# Altium project 8MPLUSLPD4-CPU.PrjPcb (part 2 of 3)

## Sheet Page07 CPU PHY.SchDoc
size 513 x 386 mm
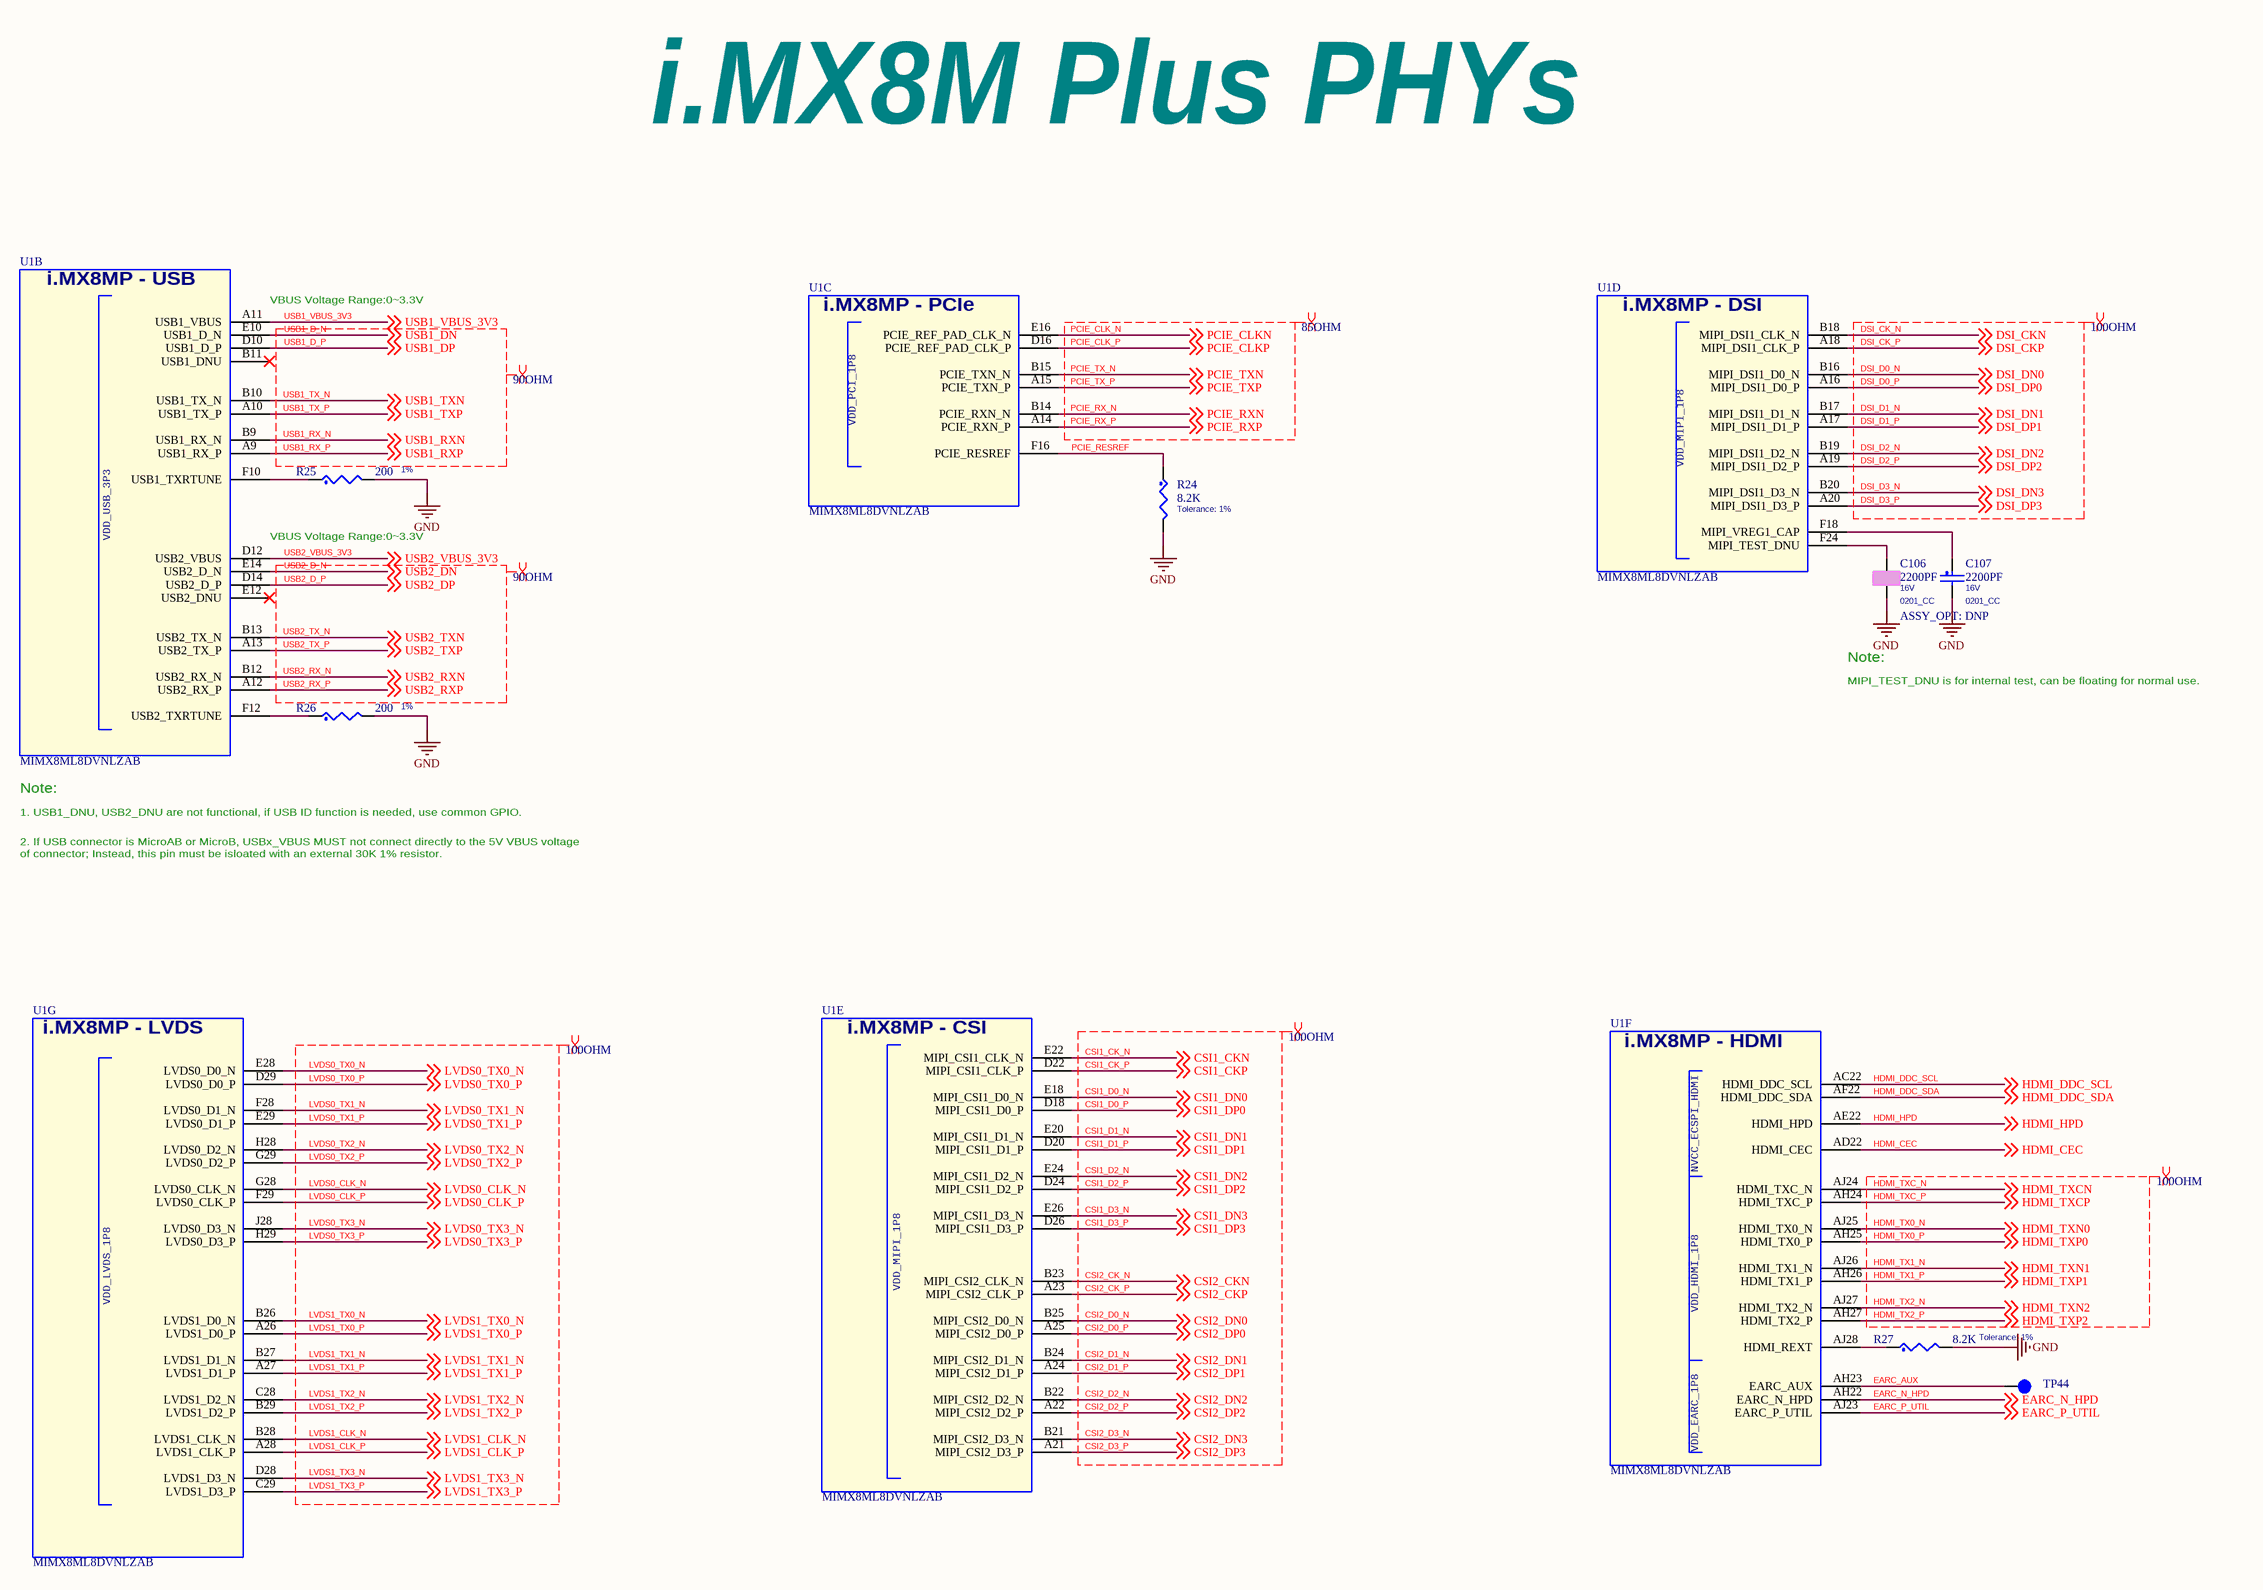
[diagram p8: Page07 CPU PHY.SchDoc]

### Parts
C106  2200PF  ASSY_OPT: DNP  VOLTAGE: 16V  [0201_CC]
C107  2200PF  VOLTAGE: 16V  [0201_CC]
R24  8.2K  Tolerance: 1%  [0201_CC]
R25  200  Tolerance: 1%  [0201_CC]
R26  200  Tolerance: 1%  [0201_CC]
R27  8.2K  Tolerance: 1%  [0201_CC]
TP44  tpad_020  [tpad_020]  (value not drawn)
U1  MIMX8ML8DVNLZAB  [BGA_M865S_0P5_15X15-BMS]  (parts B,C,D,E,F,G of 15)

### Nets
GND: C106.2 C107.2 R24.2 R25.2 R26.2 R27.2
CSI1_CK_N: U1.E22(MIPI_CSI1_CLK_N) ; off-sheet CSI1_CKN  [also labelled CSI1_CKN]
CSI1_CK_P: U1.D22(MIPI_CSI1_CLK_P) ; off-sheet CSI1_CKP  [also labelled CSI1_CKP]
CSI1_D0_N: U1.E18(MIPI_CSI1_D0_N) ; off-sheet CSI1_DN0  [also labelled CSI1_DN0]
CSI1_D0_P: U1.D18(MIPI_CSI1_D0_P) ; off-sheet CSI1_DP0  [also labelled CSI1_DP0]
CSI1_D1_N: U1.E20(MIPI_CSI1_D1_N) ; off-sheet CSI1_DN1  [also labelled CSI1_DN1]
CSI1_D1_P: U1.D20(MIPI_CSI1_D1_P) ; off-sheet CSI1_DP1  [also labelled CSI1_DP1]
CSI1_D2_N: U1.E24(MIPI_CSI1_D2_N) ; off-sheet CSI1_DN2  [also labelled CSI1_DN2]
CSI1_D2_P: U1.D24(MIPI_CSI1_D2_P) ; off-sheet CSI1_DP2  [also labelled CSI1_DP2]
CSI1_D3_N: U1.E26(MIPI_CSI1_D3_N) ; off-sheet CSI1_DN3  [also labelled CSI1_DN3]
CSI1_D3_P: U1.D26(MIPI_CSI1_D3_P) ; off-sheet CSI1_DP3  [also labelled CSI1_DP3]
CSI2_CK_N: U1.B23(MIPI_CSI2_CLK_N) ; off-sheet CSI2_CKN  [also labelled CSI2_CKN]
CSI2_CK_P: U1.A23(MIPI_CSI2_CLK_P) ; off-sheet CSI2_CKP  [also labelled CSI2_CKP]
CSI2_D0_N: U1.B25(MIPI_CSI2_D0_N) ; off-sheet CSI2_DN0  [also labelled CSI2_DN0]
CSI2_D0_P: U1.A25(MIPI_CSI2_D0_P) ; off-sheet CSI2_DP0  [also labelled CSI2_DP0]
CSI2_D1_N: U1.B24(MIPI_CSI2_D1_N) ; off-sheet CSI2_DN1  [also labelled CSI2_DN1]
CSI2_D1_P: U1.A24(MIPI_CSI2_D1_P) ; off-sheet CSI2_DP1  [also labelled CSI2_DP1]
CSI2_D2_N: U1.B22(MIPI_CSI2_D2_N) ; off-sheet CSI2_DN2  [also labelled CSI2_DN2]
CSI2_D2_P: U1.A22(MIPI_CSI2_D2_P) ; off-sheet CSI2_DP2  [also labelled CSI2_DP2]
CSI2_D3_N: U1.B21(MIPI_CSI2_D3_N) ; off-sheet CSI2_DN3  [also labelled CSI2_DN3]
CSI2_D3_P: U1.A21(MIPI_CSI2_D3_P) ; off-sheet CSI2_DP3  [also labelled CSI2_DP3]
DSI_CK_N: U1.B18(MIPI_DSI1_CLK_N) ; off-sheet DSI_CKN  [also labelled DSI_CKN]
DSI_CK_P: U1.A18(MIPI_DSI1_CLK_P) ; off-sheet DSI_CKP  [also labelled DSI_CKP]
DSI_D0_N: U1.B16(MIPI_DSI1_D0_N) ; off-sheet DSI_DN0  [also labelled DSI_DN0]
DSI_D0_P: U1.A16(MIPI_DSI1_D0_P) ; off-sheet DSI_DP0  [also labelled DSI_DP0]
DSI_D1_N: U1.B17(MIPI_DSI1_D1_N) ; off-sheet DSI_DN1  [also labelled DSI_DN1]
DSI_D1_P: U1.A17(MIPI_DSI1_D1_P) ; off-sheet DSI_DP1  [also labelled DSI_DP1]
DSI_D2_N: U1.B19(MIPI_DSI1_D2_N) ; off-sheet DSI_DN2  [also labelled DSI_DN2]
DSI_D2_P: U1.A19(MIPI_DSI1_D2_P) ; off-sheet DSI_DP2  [also labelled DSI_DP2]
DSI_D3_N: U1.B20(MIPI_DSI1_D3_N) ; off-sheet DSI_DN3  [also labelled DSI_DN3]
DSI_D3_P: U1.A20(MIPI_DSI1_D3_P) ; off-sheet DSI_DP3  [also labelled DSI_DP3]
EARC_AUX: TP44.1(Pin1) U1.AH23(EARC_AUX)
EARC_N_HPD: U1.AH22(EARC_N_HPD) ; off-sheet EARC_N_HPD
EARC_P_UTIL: U1.AJ23(EARC_P_UTIL) ; off-sheet EARC_P_UTIL
HDMI_CEC: U1.AD22(HDMI_CEC) ; off-sheet HDMI_CEC
HDMI_DDC_SCL: U1.AC22(HDMI_DDC_SCL) ; off-sheet HDMI_DDC_SCL
HDMI_DDC_SDA: U1.AF22(HDMI_DDC_SDA) ; off-sheet HDMI_DDC_SDA
HDMI_HPD: U1.AE22(HDMI_HPD) ; off-sheet HDMI_HPD
HDMI_TX0_N: U1.AJ25(HDMI_TX0_N) ; off-sheet HDMI_TXN0  [also labelled HDMI_TXN0]
HDMI_TX0_P: U1.AH25(HDMI_TX0_P) ; off-sheet HDMI_TXP0  [also labelled HDMI_TXP0]
HDMI_TX1_N: U1.AJ26(HDMI_TX1_N) ; off-sheet HDMI_TXN1  [also labelled HDMI_TXN1]
HDMI_TX1_P: U1.AH26(HDMI_TX1_P) ; off-sheet HDMI_TXP1  [also labelled HDMI_TXP1]
HDMI_TX2_N: U1.AJ27(HDMI_TX2_N) ; off-sheet HDMI_TXN2  [also labelled HDMI_TXN2]
HDMI_TX2_P: U1.AH27(HDMI_TX2_P) ; off-sheet HDMI_TXP2  [also labelled HDMI_TXP2]
HDMI_TXC_N: U1.AJ24(HDMI_TXC_N) ; off-sheet HDMI_TXCN  [also labelled HDMI_TXCN]
HDMI_TXC_P: U1.AH24(HDMI_TXC_P) ; off-sheet HDMI_TXCP  [also labelled HDMI_TXCP]
LVDS0_CLK_N: U1.G28(LVDS0_CLK_N) ; off-sheet LVDS0_CLK_N
LVDS0_CLK_P: U1.F29(LVDS0_CLK_P) ; off-sheet LVDS0_CLK_P
LVDS0_TX0_N: U1.E28(LVDS0_D0_N) ; off-sheet LVDS0_TX0_N
LVDS0_TX0_P: U1.D29(LVDS0_D0_P) ; off-sheet LVDS0_TX0_P
LVDS0_TX1_N: U1.F28(LVDS0_D1_N) ; off-sheet LVDS0_TX1_N
LVDS0_TX1_P: U1.E29(LVDS0_D1_P) ; off-sheet LVDS0_TX1_P
LVDS0_TX2_N: U1.H28(LVDS0_D2_N) ; off-sheet LVDS0_TX2_N
LVDS0_TX2_P: U1.G29(LVDS0_D2_P) ; off-sheet LVDS0_TX2_P
LVDS0_TX3_N: U1.J28(LVDS0_D3_N) ; off-sheet LVDS0_TX3_N
LVDS0_TX3_P: U1.H29(LVDS0_D3_P) ; off-sheet LVDS0_TX3_P
LVDS1_CLK_N: U1.B28(LVDS1_CLK_N) ; off-sheet LVDS1_CLK_N
LVDS1_CLK_P: U1.A28(LVDS1_CLK_P) ; off-sheet LVDS1_CLK_P
LVDS1_TX0_N: U1.B26(LVDS1_D0_N) ; off-sheet LVDS1_TX0_N
LVDS1_TX0_P: U1.A26(LVDS1_D0_P) ; off-sheet LVDS1_TX0_P
LVDS1_TX1_N: U1.B27(LVDS1_D1_N) ; off-sheet LVDS1_TX1_N
LVDS1_TX1_P: U1.A27(LVDS1_D1_P) ; off-sheet LVDS1_TX1_P
LVDS1_TX2_N: U1.C28(LVDS1_D2_N) ; off-sheet LVDS1_TX2_N
LVDS1_TX2_P: U1.B29(LVDS1_D2_P) ; off-sheet LVDS1_TX2_P
LVDS1_TX3_N: U1.D28(LVDS1_D3_N) ; off-sheet LVDS1_TX3_N
LVDS1_TX3_P: U1.C29(LVDS1_D3_P) ; off-sheet LVDS1_TX3_P
PCIE_CLK_N: U1.E16(PCIE_REF_PAD_CLK_N) ; off-sheet PCIE_CLKN  [also labelled PCIE_CLKN]
PCIE_CLK_P: U1.D16(PCIE_REF_PAD_CLK_P) ; off-sheet PCIE_CLKP  [also labelled PCIE_CLKP]
PCIE_RESREF: R24.1 U1.F16(PCIE_RESREF)
PCIE_RX_N: U1.B14(PCIE_RXN_N) ; off-sheet PCIE_RXN  [also labelled PCIE_RXN]
PCIE_RX_P: U1.A14(PCIE_RXN_P) ; off-sheet PCIE_RXP  [also labelled PCIE_RXP]
PCIE_TX_N: U1.B15(PCIE_TXN_N) ; off-sheet PCIE_TXN  [also labelled PCIE_TXN]
PCIE_TX_P: U1.A15(PCIE_TXN_P) ; off-sheet PCIE_TXP  [also labelled PCIE_TXP]
USB1_D_N: U1.E10(USB1_D_N) ; off-sheet USB1_DN  [also labelled USB1_DN]
USB1_D_P: U1.D10(USB1_D_P) ; off-sheet USB1_DP  [also labelled USB1_DP]
USB1_RX_N: U1.B9(USB1_RX_N) ; off-sheet USB1_RXN  [also labelled USB1_RXN]
USB1_RX_P: U1.A9(USB1_RX_P) ; off-sheet USB1_RXP  [also labelled USB1_RXP]
USB1_TX_N: U1.B10(USB1_TX_N) ; off-sheet USB1_TXN  [also labelled USB1_TXN]
USB1_TX_P: U1.A10(USB1_TX_P) ; off-sheet USB1_TXP  [also labelled USB1_TXP]
USB1_VBUS_3V3: U1.A11(USB1_VBUS) ; off-sheet USB1_VBUS_3V3
USB2_D_N: U1.E14(USB2_D_N) ; off-sheet USB2_DN  [also labelled USB2_DN]
USB2_D_P: U1.D14(USB2_D_P) ; off-sheet USB2_DP  [also labelled USB2_DP]
USB2_RX_N: U1.B12(USB2_RX_N) ; off-sheet USB2_RXN  [also labelled USB2_RXN]
USB2_RX_P: U1.A12(USB2_RX_P) ; off-sheet USB2_RXP  [also labelled USB2_RXP]
USB2_TX_N: U1.B13(USB2_TX_N) ; off-sheet USB2_TXN  [also labelled USB2_TXN]
USB2_TX_P: U1.A13(USB2_TX_P) ; off-sheet USB2_TXP  [also labelled USB2_TXP]
USB2_VBUS_3V3: U1.D12(USB2_VBUS) ; off-sheet USB2_VBUS_3V3
NetC106_1: C106.1 U1.F24(MIPI_TEST_DNU)
NetC107_1: C107.1 U1.F18(MIPI_VREG1_CAP)
NetR25_1: R25.1 U1.F10(USB1_TXRTUNE)
NetR26_1: R26.1 U1.F12(USB2_TXRTUNE)
NetR27_1: R27.1 U1.AJ28(HDMI_REXT)

Not connected (* = marked no-connect by the designer): U1 B11(USB1_DNU)* E12(USB2_DNU)*

### Layout directives
differential pair; net class USB; differential pair class 90OHM: USB1_D_N, USB1_D_P, USB1_DN, USB1_DP, USB1_RX_N, USB1_RX_P, USB1_RXN, USB1_RXP, USB1_TX_N, USB1_TX_P, USB1_TXN, USB1_TXP, USB2_D_N, USB2_D_P, USB2_DN, USB2_DP, USB2_RX_N, USB2_RX_P, USB2_RXN, USB2_RXP, USB2_TX_N, USB2_TX_P, USB2_TXN, USB2_TXP
differential pair; net class PCIE; differential pair class 85OHM: PCIE_CLK_N, PCIE_CLK_P, PCIE_CLKN, PCIE_CLKP, PCIE_RX_N, PCIE_RX_P, PCIE_RXN, PCIE_RXP, PCIE_TX_N, PCIE_TX_P, PCIE_TXN, PCIE_TXP
differential pair; net class DSI; differential pair class 100OHM: DSI_CK_N, DSI_CK_P, DSI_CKN, DSI_CKP, DSI_D0_N, DSI_D0_P, DSI_D1_N, DSI_D1_P, DSI_D2_N, DSI_D2_P, DSI_D3_N, DSI_D3_P, DSI_DN0, DSI_DN1, DSI_DN2, DSI_DN3, DSI_DP0, DSI_DP1, DSI_DP2, DSI_DP3
differential pair; net class HDMI; differential pair class 100OHM: HDMI_TX0_N, HDMI_TX0_P, HDMI_TX1_N, HDMI_TX1_P, HDMI_TX2_N, HDMI_TX2_P, HDMI_TXC_N, HDMI_TXC_P, HDMI_TXCN, HDMI_TXCP, HDMI_TXN0, HDMI_TXN1, HDMI_TXN2, HDMI_TXP0, HDMI_TXP1, HDMI_TXP2
differential pair; net class CSI; differential pair class 100OHM: CSI1_CK_N, CSI1_CK_P, CSI1_CKN, CSI1_CKP, CSI1_D0_N, CSI1_D0_P, CSI1_D1_N, CSI1_D1_P, CSI1_D2_N, CSI1_D2_P, CSI1_D3_N, CSI1_D3_P, CSI1_DN0, CSI1_DN1, CSI1_DN2, CSI1_DN3, CSI1_DP0, CSI1_DP1, CSI1_DP2, CSI1_DP3, CSI2_CK_N, CSI2_CK_P, CSI2_CKN, CSI2_CKP, CSI2_D0_N, CSI2_D0_P, CSI2_D1_N, CSI2_D1_P, CSI2_D2_N, CSI2_D2_P, CSI2_D3_N, CSI2_D3_P, CSI2_DN0, CSI2_DN1, CSI2_DN2, CSI2_DN3, CSI2_DP0, CSI2_DP1, CSI2_DP2, CSI2_DP3
differential pair; net class LVDS; differential pair class 100OHM: LVDS0_CLK_N, LVDS0_CLK_P, LVDS0_TX0_N, LVDS0_TX0_P, LVDS0_TX1_N, LVDS0_TX1_P, LVDS0_TX2_N, LVDS0_TX2_P, LVDS0_TX3_N, LVDS0_TX3_P, LVDS1_CLK_N, LVDS1_CLK_P, LVDS1_TX0_N, LVDS1_TX0_P, LVDS1_TX1_N, LVDS1_TX1_P, LVDS1_TX2_N, LVDS1_TX2_P, LVDS1_TX3_N, LVDS1_TX3_P

### Notes on the sheet
- i.MX8M Plus PHYs
- (near U1) VBUS Voltage Range:0~3.3V
- VBUS Voltage Range:0~3.3V
- MIPI_TEST_DNU is for internal test, can be floating for normal use.
- Note:
- 1. USB1_DNU, USB2_DNU are not functional, if USB ID function is needed, use common GPIO.
- 2. If USB connector is MicroAB or MicroB, USBx_VBUS MUST not connect directly to the 5V VBUS voltage
  of connector; Instead, this pin must be isloated with an external 30K 1% resistor.
- (in symbol MIMX8MP_BGA548, part B) i.MX8MP - USB
- (in symbol MIMX8MP_BGA548, part C) i.MX8MP - PCIe
- (in symbol MIMX8MP_BGA548, part D) i.MX8MP - DSI
- (in symbol MIMX8MP_BGA548, part E) i.MX8MP - CSI
- (in symbol MIMX8MP_BGA548, part F) i.MX8MP - HDMI
- (in symbol MIMX8MP_BGA548, part G) i.MX8MP - LVDS

### Library data of the parts
C106 = CAP_NP: CAP CER 2200PF 16V 10% X7R 0201; CLASS: DISCRETE; FPLIST: CC0201,CC0201_HD,0201_CC; CAD_APPROVED: Yes; MFG_PN01: GRM033R71C222KA88D; MFG_NAME01: MURATA; Tolerance: 20%; AGILE_PN: 150-78660; PCB Footprint: 0201_CC; HEIGHT: 0.33 MM; ROHS: Yes
C107 = CAP_NP: CAP CER 2200PF 16V 10% X7R 0201; CLASS: DISCRETE; AGILE_PN: 150-78660; Tolerance: 20%; MFG_NAME01: MURATA; MFG_PN01: GRM033R71C222KA88D; CAD_APPROVED: Yes; FPLIST: CC0201,CC0201_HD,0201_CC; PCB Footprint: 0201_CC; ROHS: Yes; HEIGHT: 0.33 MM
R24 = RES: RES MF 8.2K 1/20W 1% 0201; CLASS: DISCRETE; AGILE_PN: 470-82483; FPLIST: RC0201,0201_CC; CAD_APPROVED: Yes; MFG_NAME01: YAGEO AMERICA; MFG_PN01: RC0201FR-078K2L; PCB Footprint: 0201_CC; Package Size: 0201 (0603 Metric); HEIGHT: 0.26MM; Package Type: SMD; ROHS: Yes
R25 = RES: RES MF 200 OHM 1/20W 1% 0201; CLASS: DISCRETE; FPLIST: RC0201,0201_CC; CAD_APPROVED: Yes; Temp_Range: -55¡ãC ~ 125¡ãC; MFG_PN01: RC0201FR-07200RL; MFG_NAME01: YAGEO AMERICA; AGILE_PN: 470-82323; VOLTAGE: 25V; PCB Footprint: 0201_CC; HEIGHT: 0.26MM; ROHS: Yes; Temp Range: -55¡ãC ~ 125¡ãC
R26 = RES: RES MF 200 OHM 1/20W 1% 0201; CLASS: DISCRETE; AGILE_PN: 470-82323; MFG_NAME01: YAGEO AMERICA; MFG_PN01: RC0201FR-07200RL; Temp_Range: -55¡ãC ~ 125¡ãC; CAD_APPROVED: Yes; FPLIST: RC0201,0201_CC; VOLTAGE: 25V; PCB Footprint: 0201_CC; ROHS: Yes; HEIGHT: 0.26MM; Temp Range: -55¡ãC ~ 125¡ãC
R27 = RES: RES MF 8.2K 1/20W 1% 0201; CLASS: DISCRETE; MFG_PN01: RC0201FR-078K2L; MFG_NAME01: YAGEO AMERICA; CAD_APPROVED: Yes; FPLIST: RC0201,0201_CC; AGILE_PN: 470-82483; PCB Footprint: 0201_CC; ROHS: Yes; Package Type: SMD; HEIGHT: 0.26MM; Package Size: 0201 (0603 Metric)
TP44 = TESTLOOP: as TP49 on sheet Page04 CPU PWR; PCB Footprint: tpad_020; ROHS: Yes; HEIGHT: 0.1MM
U1 = MIMX8MP_BGA548: as U1 on sheet Page04 CPU PWR; CLASS: IC; HEIGHT: 2.1MM; MFG_PN01: MIMX8ML8DVNLZAB

## Sheet Page08 CPU MISC.SchDoc
size 297 x 209 mm
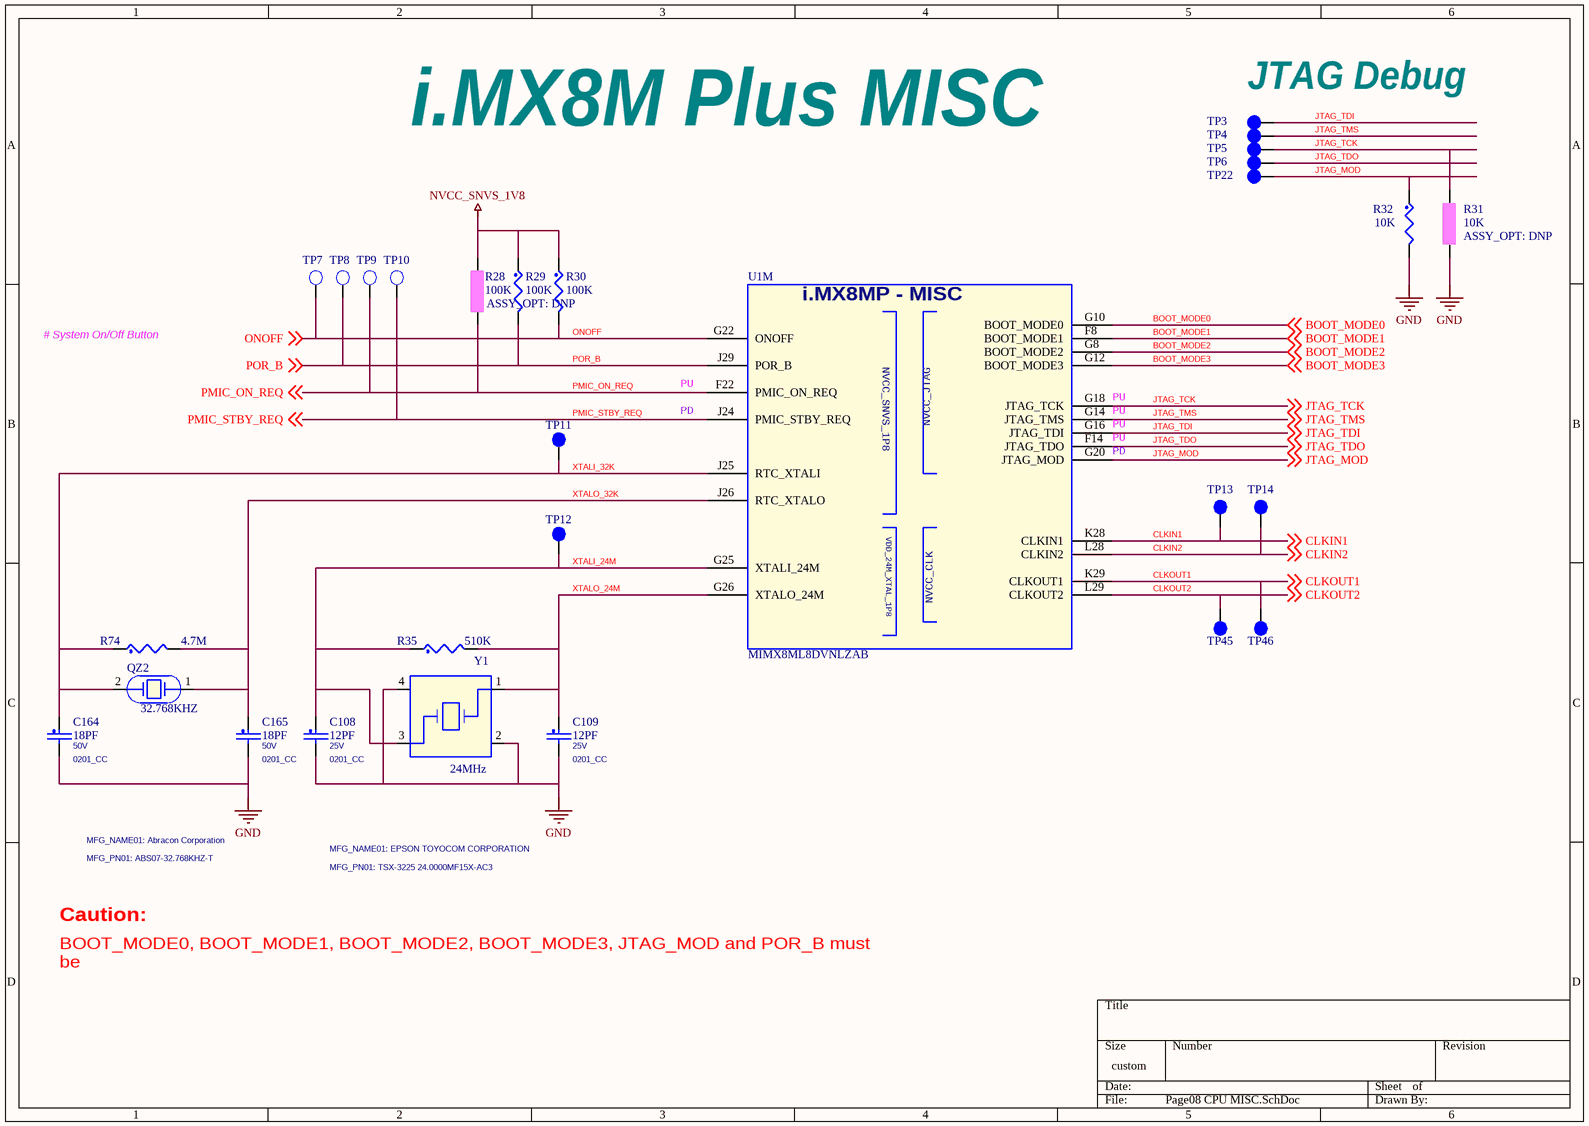
[diagram p9: Page08 CPU MISC.SchDoc]

### Parts
C108  12PF  VOLTAGE: 25V  [0201_CC]
C109  12PF  VOLTAGE: 25V  [0201_CC]
C164  18PF  VOLTAGE: 50V  [0201_CC]
C165  18PF  VOLTAGE: 50V  [0201_CC]
QZ2  32.768KHZ  MFG_PN01: ABS07-32.768KHZ-T  MFG_NAME01: Abracon Corporation  [XTAL2-3P2X1P5-SM]
R28  100K  ASSY_OPT: DNP  [0201_CC]
R29  100K  [0201_CC]
R30  100K  [0201_CC]
R31  10K  ASSY_OPT: DNP  [0201_CC]
R32  10K  [0201_CC]
R35  510K  [0402_CC]
R74  4.7M  [0201_CC]
TP3  tpad_020  [tpad_020]  (value not drawn)
TP4  tpad_020  [tpad_020]  (value not drawn)
TP5  tpad_020  [tpad_020]  (value not drawn)
TP6  tpad_020  [tpad_020]  (value not drawn)
TP7  TP_35MIL  [testpoint_35mil]  (value not drawn)
TP8  TP_35MIL  [testpoint_35mil]  (value not drawn)
TP9  TP_35MIL  [testpoint_35mil]  (value not drawn)
TP10  TP_35MIL  [testpoint_35mil]  (value not drawn)
TP11  TPAD_015  [TPAD_015]  (value not drawn)
TP12  TPAD_015  [TPAD_015]  (value not drawn)
TP13  tpad_020  [tpad_020]  (value not drawn)
TP14  tpad_020  [tpad_020]  (value not drawn)
TP22  tpad_020  [tpad_020]  (value not drawn)
TP45  tpad_020  [tpad_020]  (value not drawn)
TP46  tpad_020  [tpad_020]  (value not drawn)
U1  MIMX8ML8DVNLZAB  [BGA_M865S_0P5_15X15-BMS]  (part M of 15)
Y1  24MHz  MFG_PN01: TSX-3225 24.0000MF15X-AC3  MFG_NAME01: EPSON TOYOCOM CORPORATION  [xtlosc4_3p2x2p5mm_sm]

### Nets
GND: C108.2 C109.2 C164.2 C165.2 R31.2 R32.2 Y1.2 Y1.4
NVCC_SNVS_1V8: R28.1 R29.1 R30.1
BOOT_MODE0: U1.G10(BOOT_MODE0) ; off-sheet BOOT_MODE0
BOOT_MODE1: U1.F8(BOOT_MODE1) ; off-sheet BOOT_MODE1
BOOT_MODE2: U1.G8(BOOT_MODE2) ; off-sheet BOOT_MODE2
BOOT_MODE3: U1.G12(BOOT_MODE3) ; off-sheet BOOT_MODE3
CLKIN1: TP13.1(Pin1) U1.K28(CLKIN1) ; off-sheet CLKIN1
CLKIN2: TP14.1(Pin1) U1.L28(CLKIN2) ; off-sheet CLKIN2
CLKOUT1: TP46.1(Pin1) U1.K29(CLKOUT1) ; off-sheet CLKOUT1
CLKOUT2: TP45.1(Pin1) U1.L29(CLKOUT2) ; off-sheet CLKOUT2
JTAG_MOD: R32.1 TP22.1(Pin1) U1.G20(JTAG_MOD) ; off-sheet JTAG_MOD
JTAG_TCK: R31.1 TP5.1(Pin1) U1.G18(JTAG_TCK) ; off-sheet JTAG_TCK
JTAG_TDI: TP3.1(Pin1) U1.G16(JTAG_TDI) ; off-sheet JTAG_TDI
JTAG_TDO: TP6.1(Pin1) U1.F14(JTAG_TDO) ; off-sheet JTAG_TDO
JTAG_TMS: TP4.1(Pin1) U1.G14(JTAG_TMS) ; off-sheet JTAG_TMS
ONOFF: R30.2 TP7.1(TP) U1.G22(ONOFF) ; off-sheet ONOFF
PMIC_ON_REQ: R28.2 TP9.1(TP) U1.F22(PMIC_ON_REQ) ; off-sheet PMIC_ON_REQ
PMIC_STBY_REQ: TP10.1(TP) U1.J24(PMIC_STBY_REQ) ; off-sheet PMIC_STBY_REQ
POR_B: R29.2 TP8.1(TP) U1.J29(POR_B) ; off-sheet POR_B
XTALI_24M: C108.1 R35.1 TP12.1(Pin1) U1.G25(XTALI_24M) Y1.3
XTALI_32K: C164.1 QZ2.2 R74.1 TP11.1(Pin1) U1.J25(RTC_XTALI)
XTALO_24M: C109.1 R35.2 U1.G26(XTALO_24M) Y1.1
XTALO_32K: C165.1 QZ2.1 R74.2 U1.J26(RTC_XTALO)

### Notes on the sheet
- JTAG Debug
- i.MX8M Plus MISC
- # System On/Off Button
- PU
- (near U1) PU
- (near U1) PD
- BOOT_MODE0, BOOT_MODE1, BOOT_MODE2, BOOT_MODE3, JTAG_MOD and POR_B must be
  pulled to "111111" for i.MX8M Plus to enter Boundary Scan mode.
- Caution:
- (in symbol MIMX8MP_BGA548, part M) i.MX8MP - MISC

### Library data of the parts
C108 = CAP_NP: CAP CER 12PF 25V 5% C0G AEC-Q200 0201; CLASS: DISCRETE; FPLIST: CC0201,CC0201_HD,0201_CC; CAD_APPROVED: Yes; MFG_PN01: CGA1A2C0G1E120J030BA; MFG_NAME01: TDK; AGILE_PN: 150-79813; HEIGHT: 0.33MM; ROHS: Yes; Tolerance: 5%; PCB Footprint: 0201_CC
C109 = CAP_NP: CAP CER 12PF 25V 5% C0G AEC-Q200 0201; CLASS: DISCRETE; AGILE_PN: 150-79813; MFG_NAME01: TDK; MFG_PN01: CGA1A2C0G1E120J030BA; CAD_APPROVED: Yes; FPLIST: CC0201,CC0201_HD,0201_CC; Tolerance: 5%; ROHS: Yes; HEIGHT: 0.33MM; PCB Footprint: 0201_CC
C164 = CAP_NP: CAP CER 18pF 50V 5% C0G 0201; CLASS: DISCRETE; AGILE_PN: 150-79476; MFG_NAME01: MURATA; MFG_PN01: GRM0335C1H180JA01D; CAD_APPROVED: Yes; FPLIST: CC0201,CC0201_HD,0201_CC; Tolerance: 5%; ROHS: Yes; HEIGHT: 0.33MM; PCB Footprint: 0201_CC; Package Size: 0201; Package Type: &#966;180mm Paper taping
C165 = CAP_NP: CAP CER 18pF 50V 5% C0G 0201; CLASS: DISCRETE; FPLIST: CC0201,CC0201_HD,0201_CC; CAD_APPROVED: Yes; MFG_PN01: GRM0335C1H180JA01D; MFG_NAME01: MURATA; AGILE_PN: 150-79476; HEIGHT: 0.33MM; ROHS: Yes; Tolerance: 5%; PCB Footprint: 0201_CC; Package Size: 0201; Package Type: &#966;180mm Paper taping
QZ2 = XTAL: XTAL 32.768KHZ 12.5PF 20PPM 3.2X1.5MM SMT; CLASS: IC; CAD_APPROVED: Yes; AGILE_PN: 230-77653; PCB Footprint: XTAL2-3P2X1P5-SM; HEIGHT: 0.9MM; ROHS: Yes
R28 = RES: RES MF 100K 1/20W 1% 0201; CLASS: DISCRETE; FPLIST: RC0201,0201_CC; CAD_APPROVED: Yes; MFG_PN01: RC-0201-104FT; MFG_NAME01: SKYMOS; AGILE_PN: 470-77704; PCB Footprint: 0201_CC; HEIGHT: 0.26MM; ROHS: Yes; Tolerance: 1%
R29 R30 = RES: RES MF 100K 1/20W 1% 0201; CLASS: DISCRETE; AGILE_PN: 470-77704; MFG_NAME01: SKYMOS; MFG_PN01: RC-0201-104FT; CAD_APPROVED: Yes; FPLIST: RC0201,0201_CC; PCB Footprint: 0201_CC; Tolerance: 1%; ROHS: Yes; HEIGHT: 0.26MM
R31 = RES: RES MF 10K 1/20W 5% 0201; CLASS: DISCRETE; AGILE_PN: 470-79719; MFG_NAME01: RALEC ELECTRONIC CORP; MFG_PN01: RTT01103JTH; CAD_APPROVED: Yes; FPLIST: RC0201,0201_CC; PCB Footprint: 0201_CC; Tolerance: 5%; ROHS: Yes; HEIGHT: 0.26 MM
R32 = RES: RES MF 10K 1/20W 5% 0201; CLASS: DISCRETE; FPLIST: RC0201,0201_CC; CAD_APPROVED: Yes; MFG_PN01: RTT01103JTH; MFG_NAME01: RALEC ELECTRONIC CORP; AGILE_PN: 470-79719; PCB Footprint: 0201_CC; HEIGHT: 0.26 MM; ROHS: Yes; Tolerance: 5%
R35 = RES: RES MF 510K 1/16W 5% 0402; CLASS: DISCRETE; FPLIST: RC0402_25,RC0402_HD,0402_CC; CAD_APPROVED: Yes; MFG_PN01: ERJ-2GEJ514X; MFG_NAME01: PANASONIC; AGILE_PN: 470-76166; PCB Footprint: 0402_CC; HEIGHT: 0.4 MM; ROHS: Yes; Tolerance: 5%
R74 = RES: RES TF 4.7M OHM 1/20W 5% 0201; CLASS: DISCRETE; MFG_PN01: RC0201JR-074M7L; MFG_NAME01: YAGEO AMERICA; Temp Range: -55¡ãC ~ 125C; VOLTAGE: 25V; CAD_APPROVED: Yes; FPLIST: RC0201,0201_CC; AGILE_PN: 470-81235; ROHS: Yes; Tolerance: 5%; HEIGHT: 0.26MM; PCB Footprint: 0201_CC
TP3 TP5 TP45 TP46 = TESTLOOP: TEST POINT PAD 0.5MM DIA SMT, NO PART TO ORDER; ASSY_OPT: DNP; CLASS: IO; CAD_APPROVED: Yes; AGILE_PN: 211-77484; HEIGHT: 0.1MM; ROHS: Yes; PCB Footprint: tpad_020
TP4 TP6 TP13 TP14 TP22 = TESTLOOP: TEST POINT PAD 0.5MM DIA SMT, NO PART TO ORDER; ASSY_OPT: DNP; CLASS: IO; AGILE_PN: 211-77484; CAD_APPROVED: Yes; ROHS: Yes; HEIGHT: 0.1MM; PCB Footprint: tpad_020
TP7 TP9 = T POINT R: TEST POINT PAD .035 SMT, no part to order; CLASS: IC; ASSY_OPT: DNP; AGILE_PN: 510-75618; CAD_APPROVED: Yes; PCB Footprint: testpoint_35mil; ROHS: Yes; HEIGHT: 0.1MM
TP8 TP10 = T POINT R: TEST POINT PAD .035 SMT, no part to order; CLASS: IC; ASSY_OPT: DNP; CAD_APPROVED: Yes; AGILE_PN: 510-75618; PCB Footprint: testpoint_35mil; HEIGHT: 0.1MM; ROHS: Yes
TP11 = TESTLOOP: TEST POINT PAD 15MIL DIA SMT, NO PART TO ORDER; ASSY_OPT: DNP; CLASS: IO; CAD_APPROVED: Yes; MFG_PN01: NOTACOMPONENT; AGILE_PN: 211-76645; PCB Footprint: TPAD_015; HEIGHT: 0.1MM; ROHS: Yes; MFG_NAME01: NOTACOMPONENT
TP12 = TESTLOOP: TEST POINT PAD 15MIL DIA SMT, NO PART TO ORDER; ASSY_OPT: DNP; CLASS: IO; AGILE_PN: 211-76645; MFG_NAME01: NOTACOMPONENT; CAD_APPROVED: Yes; PCB Footprint: TPAD_015; MFG_PN01: NOTACOMPONENT; ROHS: Yes; HEIGHT: 0.1MM
U1 = MIMX8MP_BGA548: IC CPU QUAD CORTEX A53+M4 1.8GHZ BGA548; SPLIT_INST: TRUE; PCB Footprint: bga548_0p5_15x15mm; CAD_APPROVED: Yes; MFG_NAME01: NXP SEMICONDUCTORS; AGILE_PN: 330-77126; CLASS: IC; HEIGHT: 2.1MM; MFG_PN01: MIMX8ML8DVNLZAB
Y1 = XTAL_13Y: XTAL 24MHZ 9pF -- SMT 3.2X2.5MM; CLASS: IC; CAD_APPROVED: Yes; AGILE_PN: 230-77392; PCB Footprint: xtlosc4_3p2x2p5mm_sm; HEIGHT: 0.60MM; ROHS: Yes

## Sheet Page09 eMMC_QSPI.SchDoc
size 386 x 246 mm
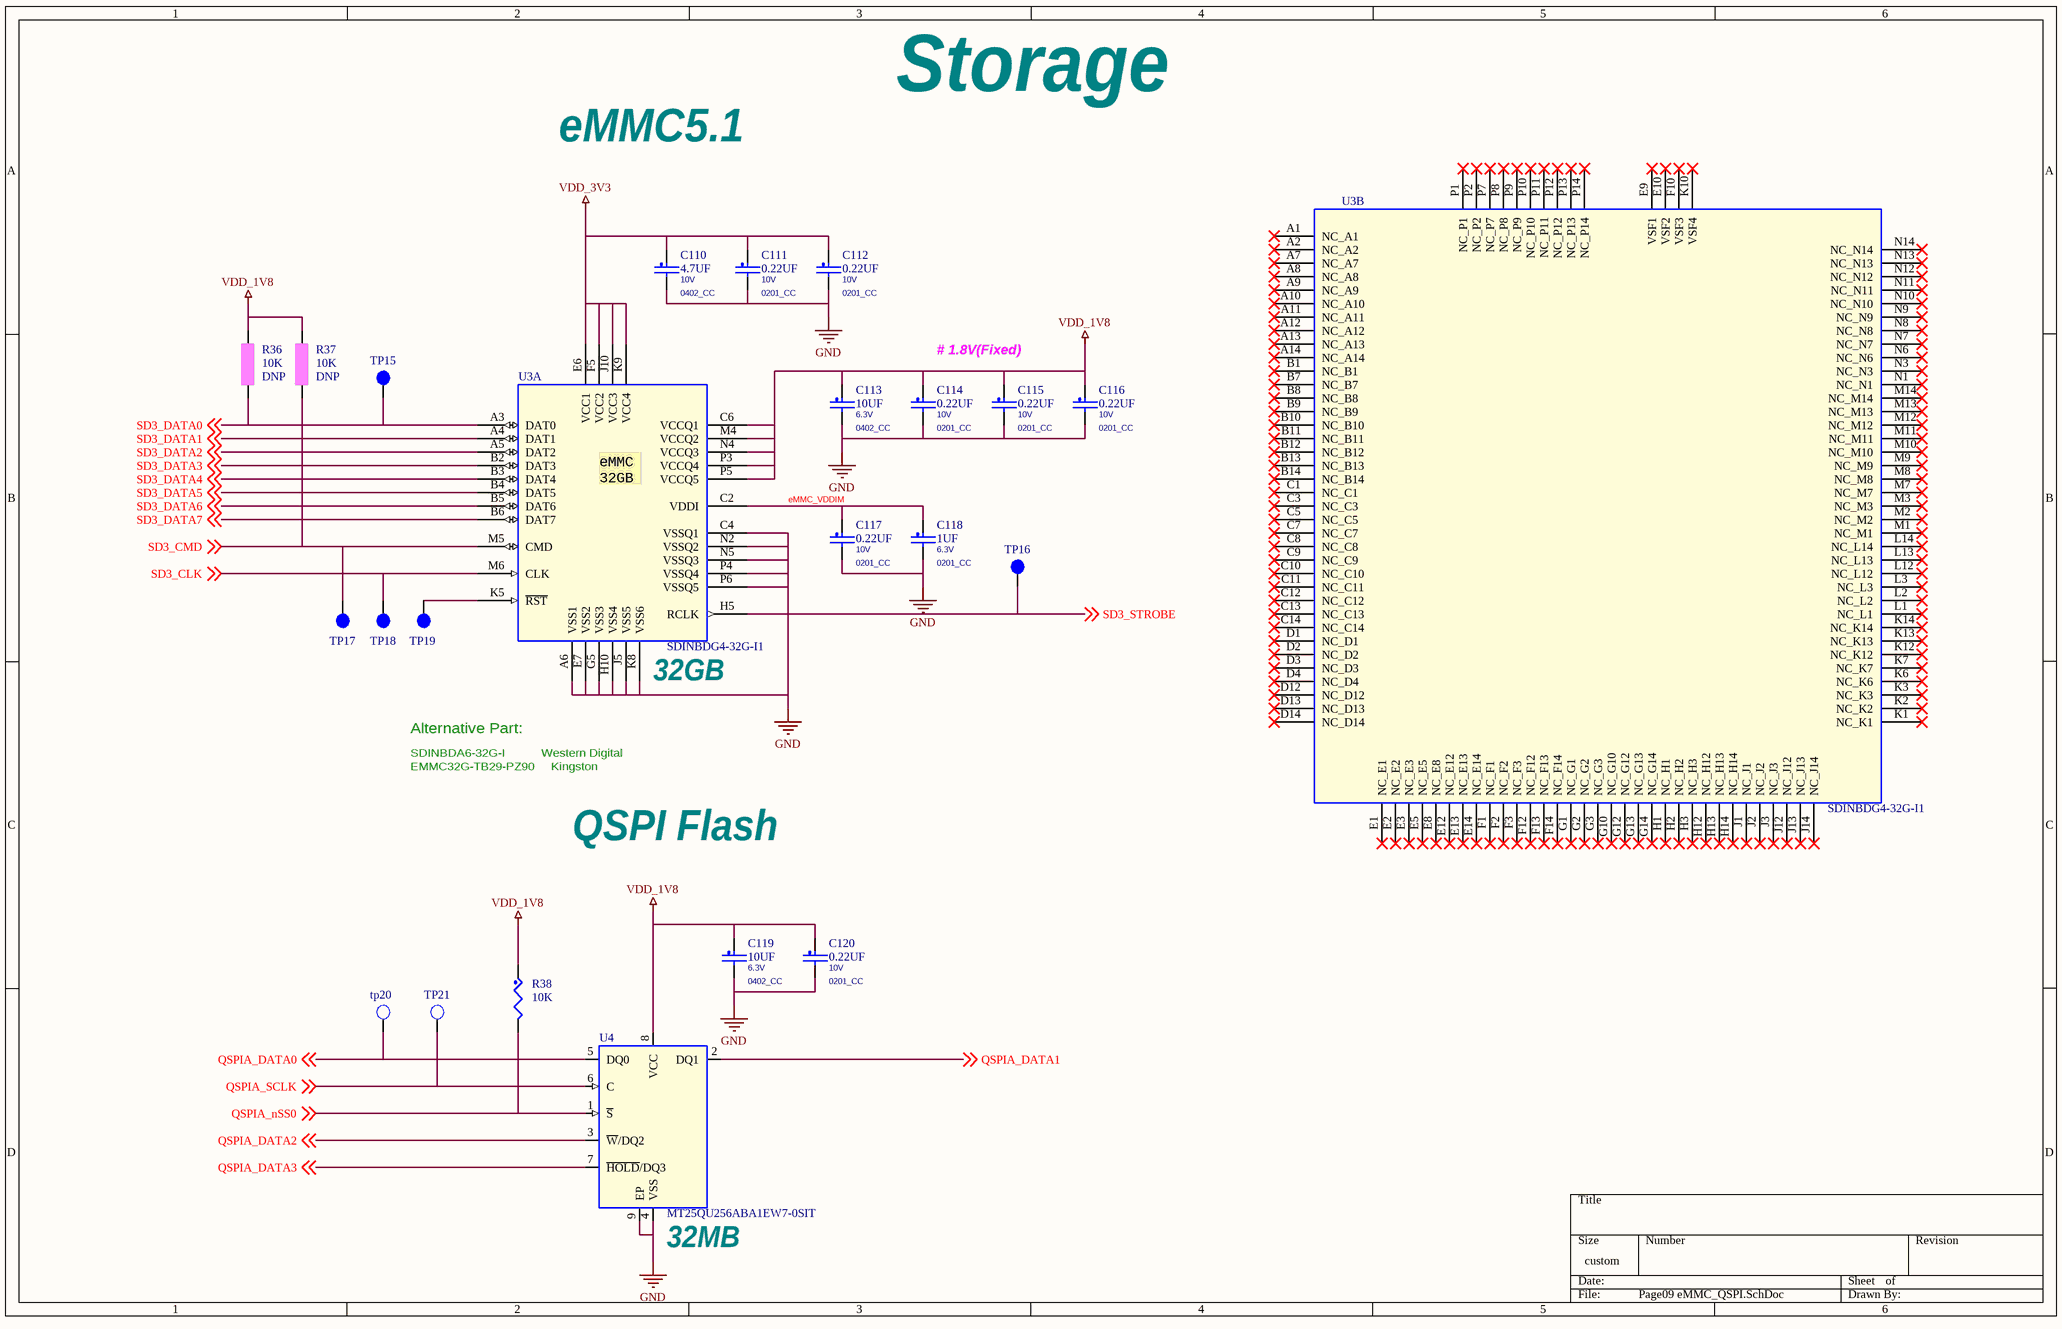
[diagram p10: Page09 eMMC_QSPI.SchDoc]

### Parts
C110  4.7UF  VOLTAGE: 10V  [0402_CC]
C111  0.22UF  VOLTAGE: 10V  [0201_CC]
C112  0.22UF  VOLTAGE: 10V  [0201_CC]
C113  10UF  VOLTAGE: 6.3V  [0402_CC]
C114  0.22UF  VOLTAGE: 10V  [0201_CC]
C115  0.22UF  VOLTAGE: 10V  [0201_CC]
C116  0.22UF  VOLTAGE: 10V  [0201_CC]
C117  0.22UF  VOLTAGE: 10V  [0201_CC]
C118  1UF  VOLTAGE: 6.3V  [0201_CC]
C119  10UF  VOLTAGE: 6.3V  [0402_CC]
C120  0.22UF  VOLTAGE: 10V  [0201_CC]
R36  10K  ASSY_OPT: DNP  [0201_CC]
R37  10K  ASSY_OPT: DNP  [0201_CC]
R38  10K  [0402_CC]
TP15  tpad_020  [tpad_020]  (value not drawn)
TP16  tpad_020  [tpad_020]  (value not drawn)
TP17  tpad_020  [tpad_020]  (value not drawn)
TP18  tpad_020  [tpad_020]  (value not drawn)
TP19  TPAD_015  [TPAD_015]  (value not drawn)
tp20  TP_35MIL  [testpoint_35mil]  (value not drawn)
TP21  TP_35MIL  [testpoint_35mil]  (value not drawn)
U3  SDINBDG4-32G-I1  [fbga153_0p5_11p5x13]  (parts A,B of 2)
U4  MT25QU256ABA1EW7-0SIT  [dfn8_1p27_6x5mm_3p1]

### Nets
GND: C110.2 C111.2 C112.2 C113.2 C114.2 C115.2 C116.2 C117.2 C118.2 C119.2 C120.2 U3.A6(VSS1) U3.C4(VSSQ1) U3.E7(VSS2) U3.G5(VSS3) U3.H10(VSS4) U3.J5(VSS5) U3.K8(VSS6) U3.N2(VSSQ2) U3.N5(VSSQ3) U3.P4(VSSQ4) U3.P6(VSSQ5) U4.4(VSS) U4.9(EP)
VDD_1V8: C113.1 C114.1 C115.1 C116.1 C119.1 C120.1 R36.1 R37.1 R38.1 U3.C6(VCCQ1) U3.M4(VCCQ2) U3.N4(VCCQ3) U3.P3(VCCQ4) U3.P5(VCCQ5) U4.8(VCC)
VDD_3V3: C110.1 C111.1 C112.1 U3.E6(VCC1) U3.F5(VCC2) U3.J10(VCC3) U3.K9(VCC4)
eMMC_VDDIM: C117.1 C118.1 U3.C2(VDDI)
QSPIA_DATA0: tp20.1(TP) U4.5(DQ0) ; off-sheet QSPIA_DATA0
QSPIA_DATA1: U4.2(DQ1) ; off-sheet QSPIA_DATA1
QSPIA_DATA2: U4.3(~{W}/DQ2) ; off-sheet QSPIA_DATA2
QSPIA_DATA3: U4.7(~{HOLD}/DQ3) ; off-sheet QSPIA_DATA3
QSPIA_nSS0: R38.2 U4.1(~{S}) ; off-sheet QSPIA_nSS0
QSPIA_SCLK: TP21.1(TP) U4.6(C) ; off-sheet QSPIA_SCLK
SD3_CLK: TP18.1(Pin1) U3.M6(CLK) ; off-sheet SD3_CLK
SD3_CMD: R37.2 TP17.1(Pin1) U3.M5(CMD) ; off-sheet SD3_CMD
SD3_DATA0: R36.2 TP15.1(Pin1) U3.A3(DAT0) ; off-sheet SD3_DATA0
SD3_DATA1: U3.A4(DAT1) ; off-sheet SD3_DATA1
SD3_DATA2: U3.A5(DAT2) ; off-sheet SD3_DATA2
SD3_DATA3: U3.B2(DAT3) ; off-sheet SD3_DATA3
SD3_DATA4: U3.B3(DAT4) ; off-sheet SD3_DATA4
SD3_DATA5: U3.B4(DAT5) ; off-sheet SD3_DATA5
SD3_DATA6: U3.B5(DAT6) ; off-sheet SD3_DATA6
SD3_DATA7: U3.B6(DAT7) ; off-sheet SD3_DATA7
SD3_STROBE: TP16.1(Pin1) U3.H5(RCLK) ; off-sheet SD3_STROBE
NetTP19_1: TP19.1(Pin1) U3.K5(~{RST})

Not connected (* = marked no-connect by the designer): U3 A1(NC_A1)* A2(NC_A2)* A7(NC_A7)* A8(NC_A8)* A9(NC_A9)* A10(NC_A10)* A11(NC_A11)* A12(NC_A12)* A13(NC_A13)* A14(NC_A14)* B1(NC_B1)* B7(NC_B7)* B8(NC_B8)* B9(NC_B9)* B10(NC_B10)* B11(NC_B11)* B12(NC_B12)* B13(NC_B13)* B14(NC_B14)* C1(NC_C1)* C3(NC_C3)* C5(NC_C5)* C7(NC_C7)* C8(NC_C8)* C9(NC_C9)* C10(NC_C10)* C11(NC_C11)* C12(NC_C12)* C13(NC_C13)* C14(NC_C14)* D1(NC_D1)* D2(NC_D2)* D3(NC_D3)* D4(NC_D4)* D12(NC_D12)* D13(NC_D13)* D14(NC_D14)* E1(NC_E1)* E2(NC_E2)* E3(NC_E3)* E5(NC_E5)* E8(NC_E8)* E9(VSF1)* E10(VSF2)* E12(NC_E12)* E13(NC_E13)* E14(NC_E14)* F1(NC_F1)* F2(NC_F2)* F3(NC_F3)* F10(VSF3)* F12(NC_F12)* F13(NC_F13)* F14(NC_F14)* G1(NC_G1)* G2(NC_G2)* G3(NC_G3)* G10(NC_G10)* G12(NC_G12)* G13(NC_G13)* G14(NC_G14)* H1(NC_H1)* H2(NC_H2)* H3(NC_H3)* H12(NC_H12)* H13(NC_H13)* H14(NC_H14)* J1(NC_J1)* J2(NC_J2)* J3(NC_J3)* J12(NC_J12)* J13(NC_J13)* J14(NC_J14)* K1(NC_K1)* K2(NC_K2)* K3(NC_K3)* K6(NC_K6)* K7(NC_K7)* K10(VSF4)* K12(NC_K12)* K13(NC_K13)* K14(NC_K14)* L1(NC_L1)* L2(NC_L2)* L3(NC_L3)* L12(NC_L12)* L13(NC_L13)* L14(NC_L14)* M1(NC_M1)* M2(NC_M2)* M3(NC_M3)* M7(NC_M7)* M8(NC_M8)* M9(NC_M9)* M10(NC_M10)* M11(NC_M11)* M12(NC_M12)* M13(NC_M13)* M14(NC_M14)* N1(NC_N1)* N3(NC_N3)* N6(NC_N6)* N7(NC_N7)* N8(NC_N8)* N9(NC_N9)* N10(NC_N10)* N11(NC_N11)* N12(NC_N12)* N13(NC_N13)* N14(NC_N14)* P1(NC_P1)* P2(NC_P2)* P7(NC_P7)* P8(NC_P8)* P9(NC_P9)* P10(NC_P10)* P11(NC_P11)* P12(NC_P12)* P13(NC_P13)* P14(NC_P14)*

### Notes on the sheet
- Storage
- eMMC5.1
- # 1.8V(Fixed)
- Alternative Part:
- (near U3) 32GB
- SDINBDA6-32G-I           Western Digital
- EMMC32G-TB29-PZ90     Kingston
- QSPI Flash
- (near U4) 32MB
- (in symbol SDINBDG4-16G_VFBGA_153P, part A) eMMC / 32GB

### Library data of the parts
C110 = CAP_NP: CAP CER 4.7uF 10V 10% X5R 0402; CLASS: DISCRETE; FPLIST: CC0402_25,CC0402_HD,0402_CC; CAD_APPROVED: Yes; MFG_PN01: CL05A475KP5NRNC; MFG_NAME01: Samsung Electro Mechanics; AGILE_PN: 150-80044; HEIGHT: 0.65MM; ROHS: Yes; Tolerance: 10%; PCB Footprint: 0402_CC
C111 C114-C116 = CAP_NP: CAP CER 0.22UF 10V 20% X5R 0201; CLASS: DISCRETE; FPLIST: CC0201,CC0201_HD,0201_CC; CAD_APPROVED: Yes; MFG_PN01: LMK063BJ224MP-F; MFG_NAME01: Taiyo Yuden; AGILE_PN: 150-78815; HEIGHT: 0.33MM; ROHS: Yes; Tolerance: 20%; PCB Footprint: 0201_CC
C112 C117 C120 = CAP_NP: CAP CER 0.22UF 10V 20% X5R 0201; CLASS: DISCRETE; AGILE_PN: 150-78815; MFG_NAME01: Taiyo Yuden; MFG_PN01: LMK063BJ224MP-F; CAD_APPROVED: Yes; FPLIST: CC0201,CC0201_HD,0201_CC; Tolerance: 20%; ROHS: Yes; HEIGHT: 0.33MM; PCB Footprint: 0201_CC
C113 = CAP_NP: CAP CER 10UF 6.3V 20% X5R 0402; CLASS: DISCRETE; FPLIST: CC0402_25,CC0402_HD,0402_CC; CAD_APPROVED: Yes; MFG_PN01: CL05A106MQ5NUNC; MFG_NAME01: SAMSUNG ELECTRO MECHANICS; AGILE_PN: 150-79163; HEIGHT: 0.65 MM; ROHS: Yes; Tolerance: 20%; PCB Footprint: 0402_CC
C118 = CAP_NP: CAP CER 1uF 6.3V 20% X5R 0201; CLASS: DISCRETE; FPLIST: CC0201,CC0201_HD,0201_CC,0201_CC_012SM_NSP; CAD_APPROVED: Yes; MFG_PN01: 02016D105MAT2A; MFG_NAME01: AVX; AGILE_PN: 150-79407; HEIGHT: 0.35MM; ROHS: Yes; Tolerance: 20%; PCB Footprint: 0201_CC; Package Size: 0201; Package Type: 7¡± reel
C119 = CAP_NP: CAP CER 10UF 6.3V 20% X5R 0402; CLASS: DISCRETE; AGILE_PN: 150-79163; MFG_NAME01: SAMSUNG ELECTRO MECHANICS; MFG_PN01: CL05A106MQ5NUNC; CAD_APPROVED: Yes; FPLIST: CC0402_25,CC0402_HD,0402_CC; Tolerance: 20%; ROHS: Yes; HEIGHT: 0.65 MM; PCB Footprint: 0402_CC
R36 R37 = RES: as R31 on sheet Page08 CPU MISC; PCB Footprint: 0201_CC; Tolerance: 5%; ROHS: Yes; HEIGHT: 0.26 MM
R38 = RES: RES MF 10K 1/16W 5% 0402; CLASS: DISCRETE; FPLIST: RC0402_25,RC0402_HD,0402_CC; CAD_APPROVED: Yes; MFG_PN01: CRCW040210K0JNED; MFG_NAME01: VISHAY INTERTECHNOLOGY; AGILE_PN: 470-75557; PCB Footprint: 0402_CC; ROHS: Yes; Tolerance: 5%; HEIGHT: 0.4 MM
TP15 = TESTLOOP: as TP4 on sheet Page08 CPU MISC; PCB Footprint: tpad_020; ROHS: Yes; HEIGHT: 0.1MM
TP16-TP18 = TESTLOOP: as TP3 on sheet Page08 CPU MISC; PCB Footprint: tpad_020; HEIGHT: 0.1MM; ROHS: Yes
TP19 = TESTLOOP: as TP11 on sheet Page08 CPU MISC; HEIGHT: 0.1MM; ROHS: Yes; MFG_NAME01: NOTACOMPONENT; PCB Footprint: TPAD_015
tp20 TP21 = T POINT R: as TP8 on sheet Page08 CPU MISC; PCB Footprint: testpoint_35mil; HEIGHT: 0.1MM; ROHS: Yes
U3 = SDINBDG4-16G_VFBGA_153P: IC MEM NAND FLASH 32GB eMMC 5.1 CTLR 2.7-3.6V FBGA153; AGILE_PN: 342-00840; Supply Voltage: 2.7 V to 3.6 V; Temp Range: -25¡ãC to +85¡ãC; MFG_NAME01: SanDisk; CLASS: IC; Package Size: 11.5 mm x 13 mm x 1 mm; HEIGHT: 1MM; ROHS: YES; VOLTAGE: 2.7-3.6V; MFG_PN01: SDINBDG4-32G-I1; PCB Footprint: fbga153_0p5_11p5x13
U4 = MT25QL256ABA1EW9_9P: IC MEM FLASH SERIAL NOR 256MBIT 166MHZ 1.7-2V WPDFN8; AGILE_PN: 334-77688; MFG_NAME01: MICRON; CAD_APPROVED: Yes; CLASS: IC; PCB Footprint: dfn8_1p27_6x5mm_3p1; MFG_PN01: MT25QU256ABA1EW7-0SIT; ROHS: Yes; HEIGHT: 0.8 MM; VOLTAGE: 1.7-2V

## Sheet Page10 BOOT_CFG.SchDoc
size 594 x 420 mm
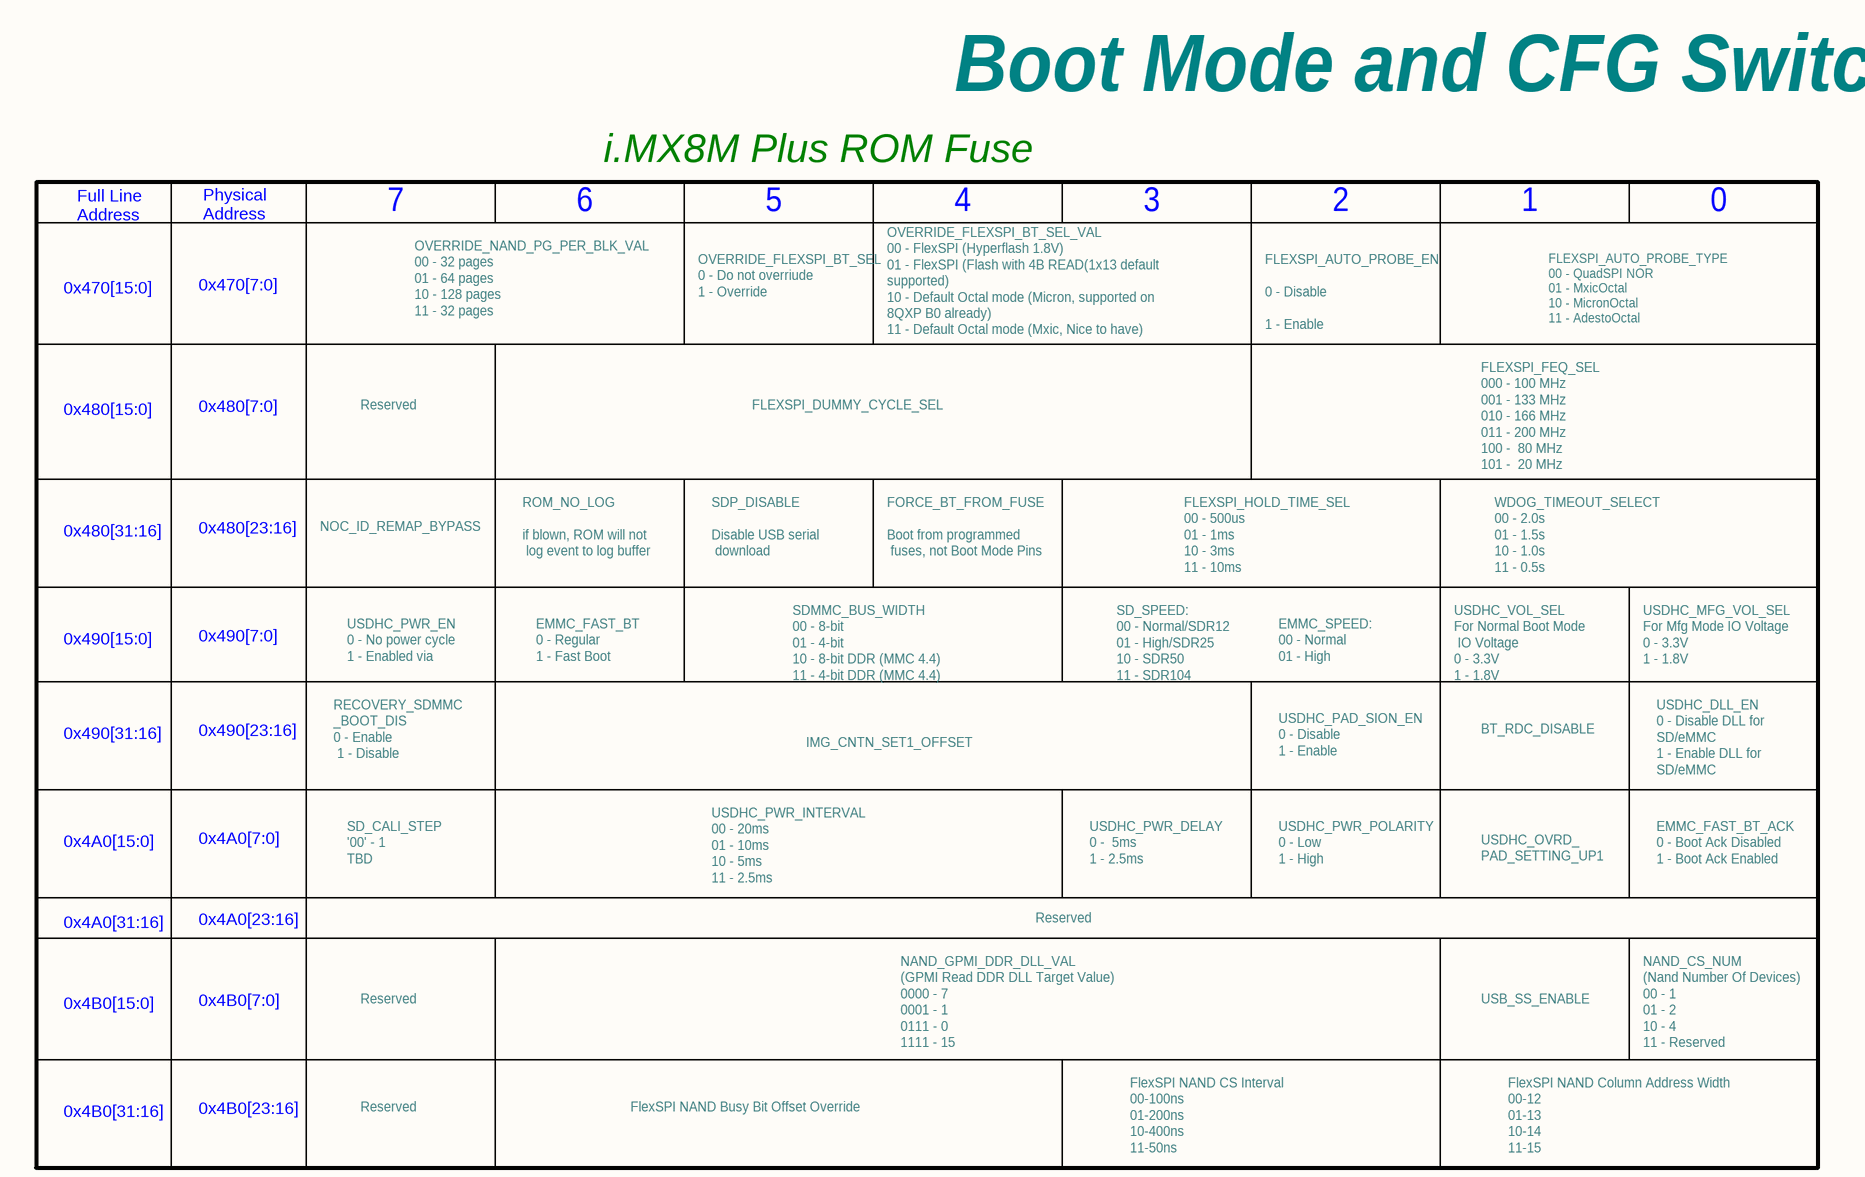
[diagram p11: Page10 BOOT_CFG.SchDoc, top left]
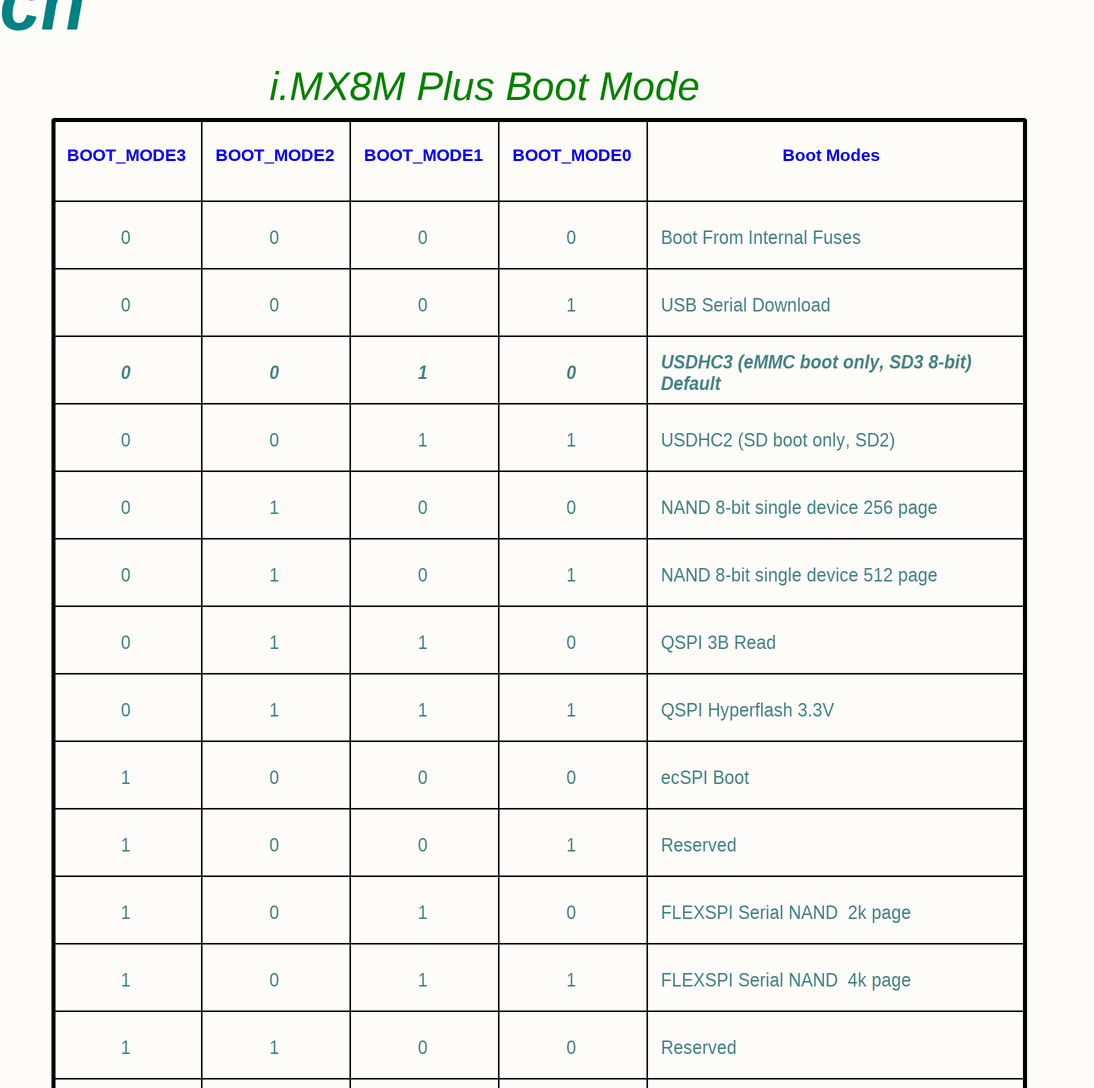
[diagram p12: Page10 BOOT_CFG.SchDoc, top right]
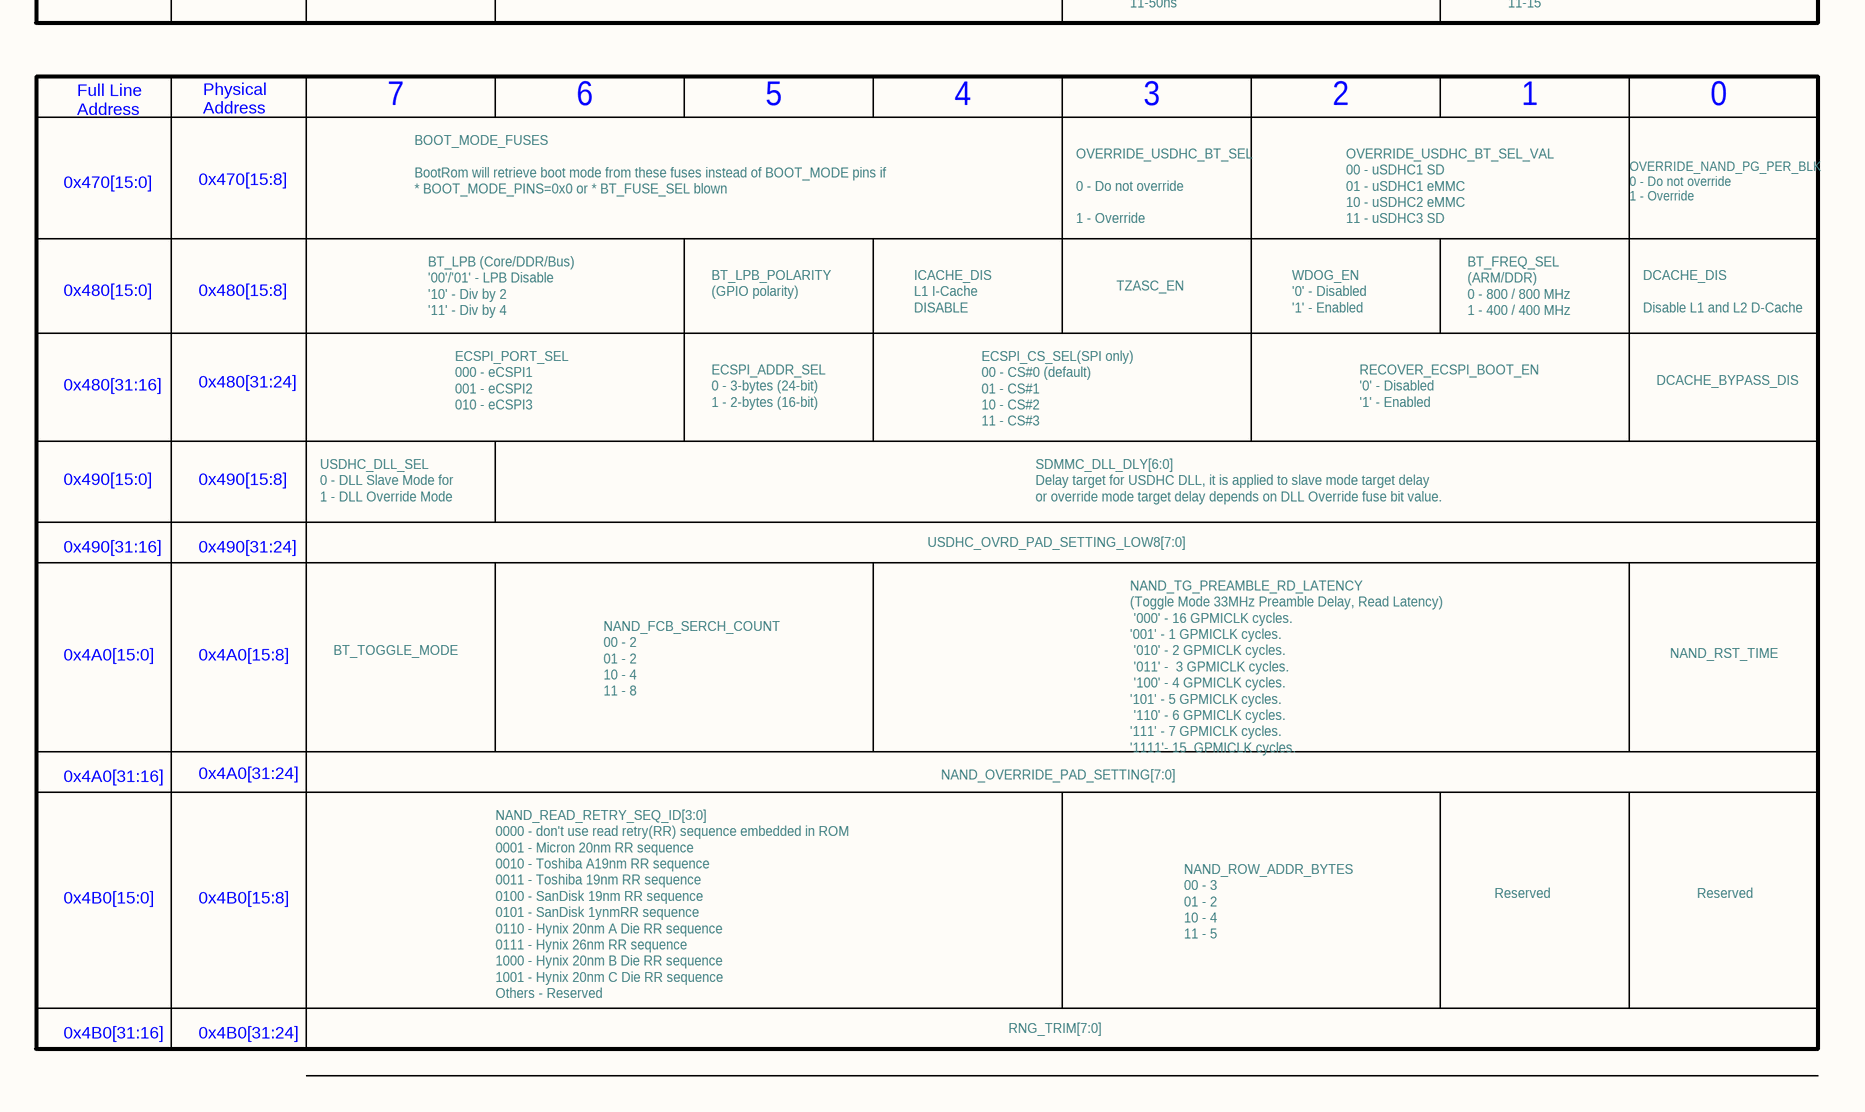
[diagram p13: Page10 BOOT_CFG.SchDoc, bottom left]
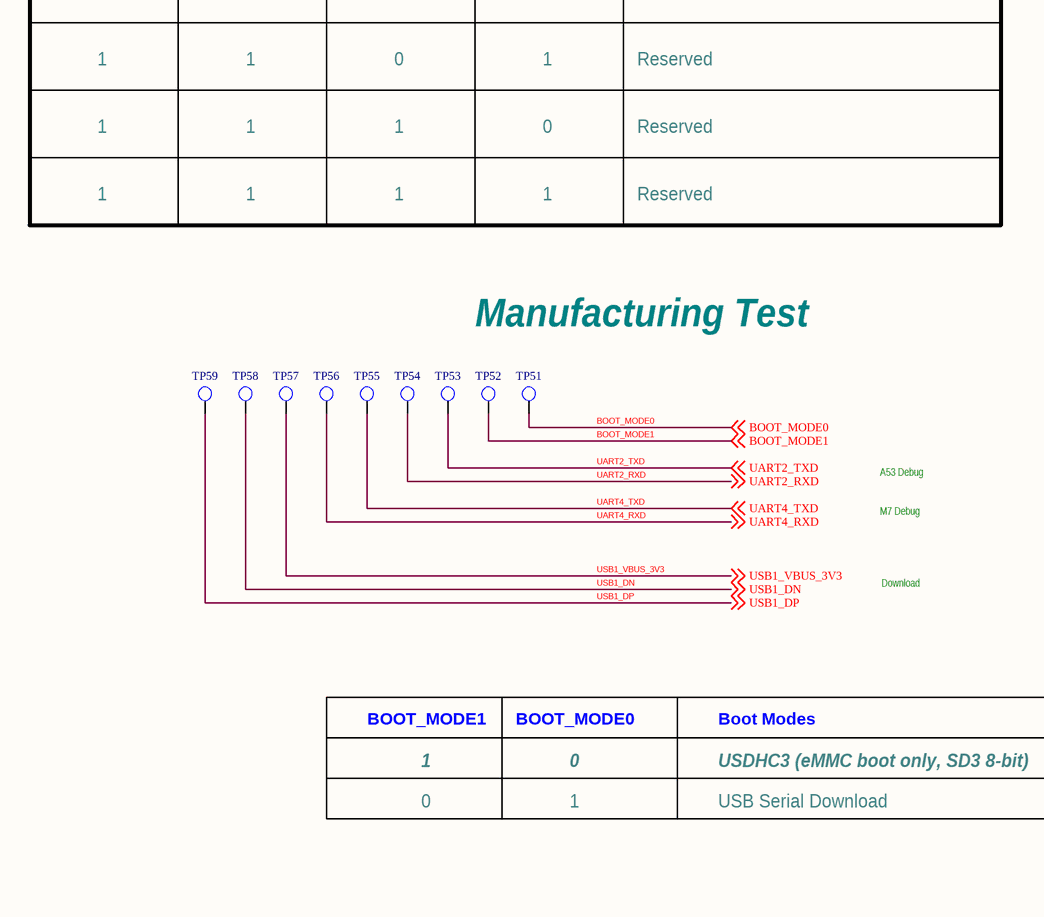
[diagram p14: Page10 BOOT_CFG.SchDoc, bottom right]

### Parts
TP51  TP_35MIL  [testpoint_35mil]  (value not drawn)
TP52  TP_35MIL  [testpoint_35mil]  (value not drawn)
TP53  TP_35MIL  [testpoint_35mil]  (value not drawn)
TP54  TP_35MIL  [testpoint_35mil]  (value not drawn)
TP55  TP_35MIL  [testpoint_35mil]  (value not drawn)
TP56  TP_35MIL  [testpoint_35mil]  (value not drawn)
TP57  TP_35MIL  [testpoint_35mil]  (value not drawn)
TP58  TP_35MIL  [testpoint_35mil]  (value not drawn)
TP59  TP_35MIL  [testpoint_35mil]  (value not drawn)

### Nets
BOOT_MODE0: TP51.1(TP) ; off-sheet BOOT_MODE0
BOOT_MODE1: TP52.1(TP) ; off-sheet BOOT_MODE1
UART2_RXD: TP54.1(TP) ; off-sheet UART2_RXD
UART2_TXD: TP53.1(TP) ; off-sheet UART2_TXD
UART4_RXD: TP56.1(TP) ; off-sheet UART4_RXD
UART4_TXD: TP55.1(TP) ; off-sheet UART4_TXD
USB1_DN: TP58.1(TP) ; off-sheet USB1_DN  [project net USB1_D_N]
USB1_DP: TP59.1(TP) ; off-sheet USB1_DP  [project net USB1_D_P]
USB1_VBUS_3V3: TP57.1(TP) ; off-sheet USB1_VBUS_3V3

### Notes on the sheet
- Boot Mode and CFG Switch
- Full Line
  Address
- Physical
  Address
- 7
- 6
- i.MX8M Plus ROM Fuse
- 5
- OVERRIDE_FLEXSPI_BT_SEL_VAL
  00 - FlexSPI (Hyperflash 1.8V)
  01 - FlexSPI (Flash with 4B READ(1x13 default
  supported)
  10 - Default Octal mode (Micron, supported on
  8QXP B0 already)
  11 - Default Octal mode (Mxic, Nice to have)
- 4
- 3
- 2
- 1
- 0
- BOOT_MODE3
- BOOT_MODE2
- i.MX8M Plus Boot Mode
- BOOT_MODE1
- BOOT_MODE0
- Boot Modes
- 0x470[15:0]
- 0x470[7:0]
- OVERRIDE_NAND_PG_PER_BLK_VAL
  00 - 32 pages
  01 - 64 pages
  10 - 128 pages
  11 - 32 pages
- OVERRIDE_FLEXSPI_BT_SEL
  0 - Do not overriude
  1 - Override
- FLEXSPI_AUTO_PROBE_EN
  0 - Disable
  1 - Enable
- FLEXSPI_AUTO_PROBE_TYPE
  00 - QuadSPI NOR
  01 - MxicOctal
  10 - MicronOctal
  11 - AdestoOctal
- FLEXSPI_FEQ_SEL
  000 - 100 MHz
  001 - 133 MHz
  010 - 166 MHz
  011 - 200 MHz
  100 -  80 MHz
  101 -  20 MHz
- Boot From Internal Fuses
- 0x480[15:0]
- 0x480[7:0]
- Reserved
- FLEXSPI_DUMMY_CYCLE_SEL
- USB Serial Download
- USDHC3 (eMMC boot only, SD3 8-bit)
  Default
- ROM_NO_LOG
  if blown, ROM will not
  log event to log buffer
- SDP_DISABLE
  Disable USB serial
  download
- FORCE_BT_FROM_FUSE
  Boot from programmed
  fuses, not Boot Mode Pins
- FLEXSPI_HOLD_TIME_SEL
  00 - 500us
  01 - 1ms
  10 - 3ms
  11 - 10ms
- WDOG_TIMEOUT_SELECT
  00 - 2.0s
  01 - 1.5s
  10 - 1.0s
  11 - 0.5s
- 0x480[31:16]
- 0x480[23:16]
- NOC_ID_REMAP_BYPASS
- USDHC2 (SD boot only, SD2)
- 0x490[15:0]
- USDHC_PWR_EN
  0 - No power cycle
  1 - Enabled via
- EMMC_FAST_BT
  0 - Regular
  1 - Fast Boot
- SDMMC_BUS_WIDTH
  00 - 8-bit
  01 - 4-bit
  10 - 8-bit DDR (MMC 4.4)
  11 - 4-bit DDR (MMC 4.4)
- SD_SPEED:
  00 - Normal/SDR12
  01 - High/SDR25
  10 - SDR50
  11 - SDR104
- EMMC_SPEED:
  00 - Normal
  01 - High
- USDHC_VOL_SEL
  For Normal Boot Mode
  IO Voltage
  0 - 3.3V
  1 - 1.8V
- USDHC_MFG_VOL_SEL
  For Mfg Mode IO Voltage
  0 - 3.3V
  1 - 1.8V
- NAND 8-bit single device 256 page
- 0x490[7:0]
- RECOVERY_SDMMC
  _BOOT_DIS
  0 - Enable
  1 - Disable
- USDHC_DLL_EN
  0 - Disable DLL for
  SD/eMMC
  1 - Enable DLL for
  SD/eMMC
- NAND 8-bit single device 512 page
- 0x490[31:16]
- 0x490[23:16]
- IMG_CNTN_SET1_OFFSET
- USDHC_PAD_SION_EN
  0 - Disable
  1 - Enable
- BT_RDC_DISABLE
- QSPI 3B Read
- 0x4A0[15:0]
- SD_CALI_STEP
  '00' - 1
  TBD
- USDHC_PWR_INTERVAL
  00 - 20ms
  01 - 10ms
  10 - 5ms
  11 - 2.5ms
- USDHC_PWR_DELAY
  0 -  5ms
  1 - 2.5ms
- USDHC_PWR_POLARITY
  0 - Low
  1 - High
- USDHC_OVRD_
  PAD_SETTING_UP1
- EMMC_FAST_BT_ACK
  0 - Boot Ack Disabled
  1 - Boot Ack Enabled
- QSPI Hyperflash 3.3V
- 0x4A0[7:0]
- ecSPI Boot
- 0x4A0[31:16]
- 0x4A0[23:16]
- NAND_GPMI_DDR_DLL_VAL
  (GPMI Read DDR DLL Target Value)
  0000 - 7
  0001 - 1
  0111 - 0
  1111 - 15
- NAND_CS_NUM
  (Nand Number Of Devices)
  00 - 1
  01 - 2
  10 - 4
  11 - Reserved
- 0x4B0[15:0]
- 0x4B0[7:0]
- USB_SS_ENABLE
- FLEXSPI Serial NAND  2k page
- 0x4B0[31:16]
- FlexSPI NAND CS Interval
  00-100ns
  01-200ns
  10-400ns
  11-50ns
- FlexSPI NAND Column Address Width
  00-12
  01-13
  10-14
  11-15
- FLEXSPI Serial NAND  4k page
- 0x4B0[23:16]
- FlexSPI NAND Busy Bit Offset Override
- BOOT_MODE_FUSES
  BootRom will retrieve boot mode from these fuses instead of BOOT_MODE pins if
  * BOOT_MODE_PINS=0x0 or * BT_FUSE_SEL blown
- OVERRIDE_USDHC_BT_SEL
  0 - Do not override
  1 - Override
- OVERRIDE_USDHC_BT_SEL_VAL
  00 - uSDHC1 SD
  01 - uSDHC1 eMMC
  10 - uSDHC2 eMMC
  11 - uSDHC3 SD
- OVERRIDE_NAND_PG_PER_BLK
  0 - Do not override
  1 - Override
- 0x470[15:8]
- 0x480[15:8]
- BT_LPB (Core/DDR/Bus)
  '00'/'01' - LPB Disable
  '10' - Div by 2
  '11' - Div by 4
- BT_LPB_POLARITY
  (GPIO polarity)
- ICACHE_DIS
  L1 I-Cache
  DISABLE
- TZASC_EN
- WDOG_EN
  '0' - Disabled
  '1' - Enabled
- BT_FREQ_SEL
  (ARM/DDR)
  0 - 800 / 800 MHz
  1 - 400 / 400 MHz
- DCACHE_DIS
  Disable L1 and L2 D-Cache
- ECSPI_PORT_SEL
  000 - eCSPI1
  001 - eCSPI2
  010 - eCSPI3
- ECSPI_ADDR_SEL
  0 - 3-bytes (24-bit)
  1 - 2-bytes (16-bit)
- ECSPI_CS_SEL(SPI only)
  00 - CS#0 (default)
  01 - CS#1
  10 - CS#2
  11 - CS#3
- RECOVER_ECSPI_BOOT_EN
  '0' - Disabled
  '1' - Enabled
- Manufacturing Test
- 0x480[31:24]
- DCACHE_BYPASS_DIS
- 0x490[15:8]
- USDHC_DLL_SEL
  0 - DLL Slave Mode for
  1 - DLL Override Mode
- SDMMC_DLL_DLY[6:0]
  Delay target for USDHC DLL, it is applied to slave mode target delay
  or override mode target delay depends on DLL Override fuse bit value.
- M7 Debug
- A53 Debug
- 0x490[31:24]
- USDHC_OVRD_PAD_SETTING_LOW8[7:0]
- Download
- NAND_FCB_SERCH_COUNT
  00 - 2
  01 - 2
  10 - 4
  11 - 8
- NAND_TG_PREAMBLE_RD_LATENCY
  (Toggle Mode 33MHz Preamble Delay, Read Latency)
  '000' - 16 GPMICLK cycles.
  '001' - 1 GPMICLK cycles.
  '010' - 2 GPMICLK cycles.
  '011' -  3 GPMICLK cycles.
  '100' - 4 GPMICLK cycles.
  '101' - 5 GPMICLK cycles.
  '110' - 6 GPMICLK cycles.
  '111' - 7 GPMICLK cycles.
  '1111'- 15  GPMICLK cycles.
- 0x4A0[15:8]
- BT_TOGGLE_MODE
- NAND_RST_TIME
- NAND_OVERRIDE_PAD_SETTING[7:0]
- USDHC3 (eMMC boot only, SD3 8-bit)
- 0x4A0[31:24]
- NAND_READ_RETRY_SEQ_ID[3:0]
  0000 - don't use read retry(RR) sequence embedded in ROM
  0001 - Micron 20nm RR sequence
  0010 - Toshiba A19nm RR sequence
  0011 - Toshiba 19nm RR sequence
  0100 - SanDisk 19nm RR sequence
  0101 - SanDisk 1ynmRR sequence
  0110 - Hynix 20nm A Die RR sequence
  0111 - Hynix 26nm RR sequence
  1000 - Hynix 20nm B Die RR sequence
  1001 - Hynix 20nm C Die RR sequence
  Others - Reserved
- 0x4B0[15:8]
- NAND_ROW_ADDR_BYTES
  00 - 3
  01 - 2
  10 - 4
  11 - 5
- 0x4B0[31:24]
- RNG_TRIM[7:0]

### Library data of the parts
TP51 TP54 TP56 TP58 = T POINT R: as TP7 on sheet Page08 CPU MISC; PCB Footprint: testpoint_35mil; ROHS: Yes; HEIGHT: 0.1MM
TP52 TP53 TP55 TP57 TP59 = T POINT R: as TP8 on sheet Page08 CPU MISC; PCB Footprint: testpoint_35mil; HEIGHT: 0.1MM; ROHS: Yes

## Sheet Page11 PMIC.SchDoc
size 513 x 386 mm
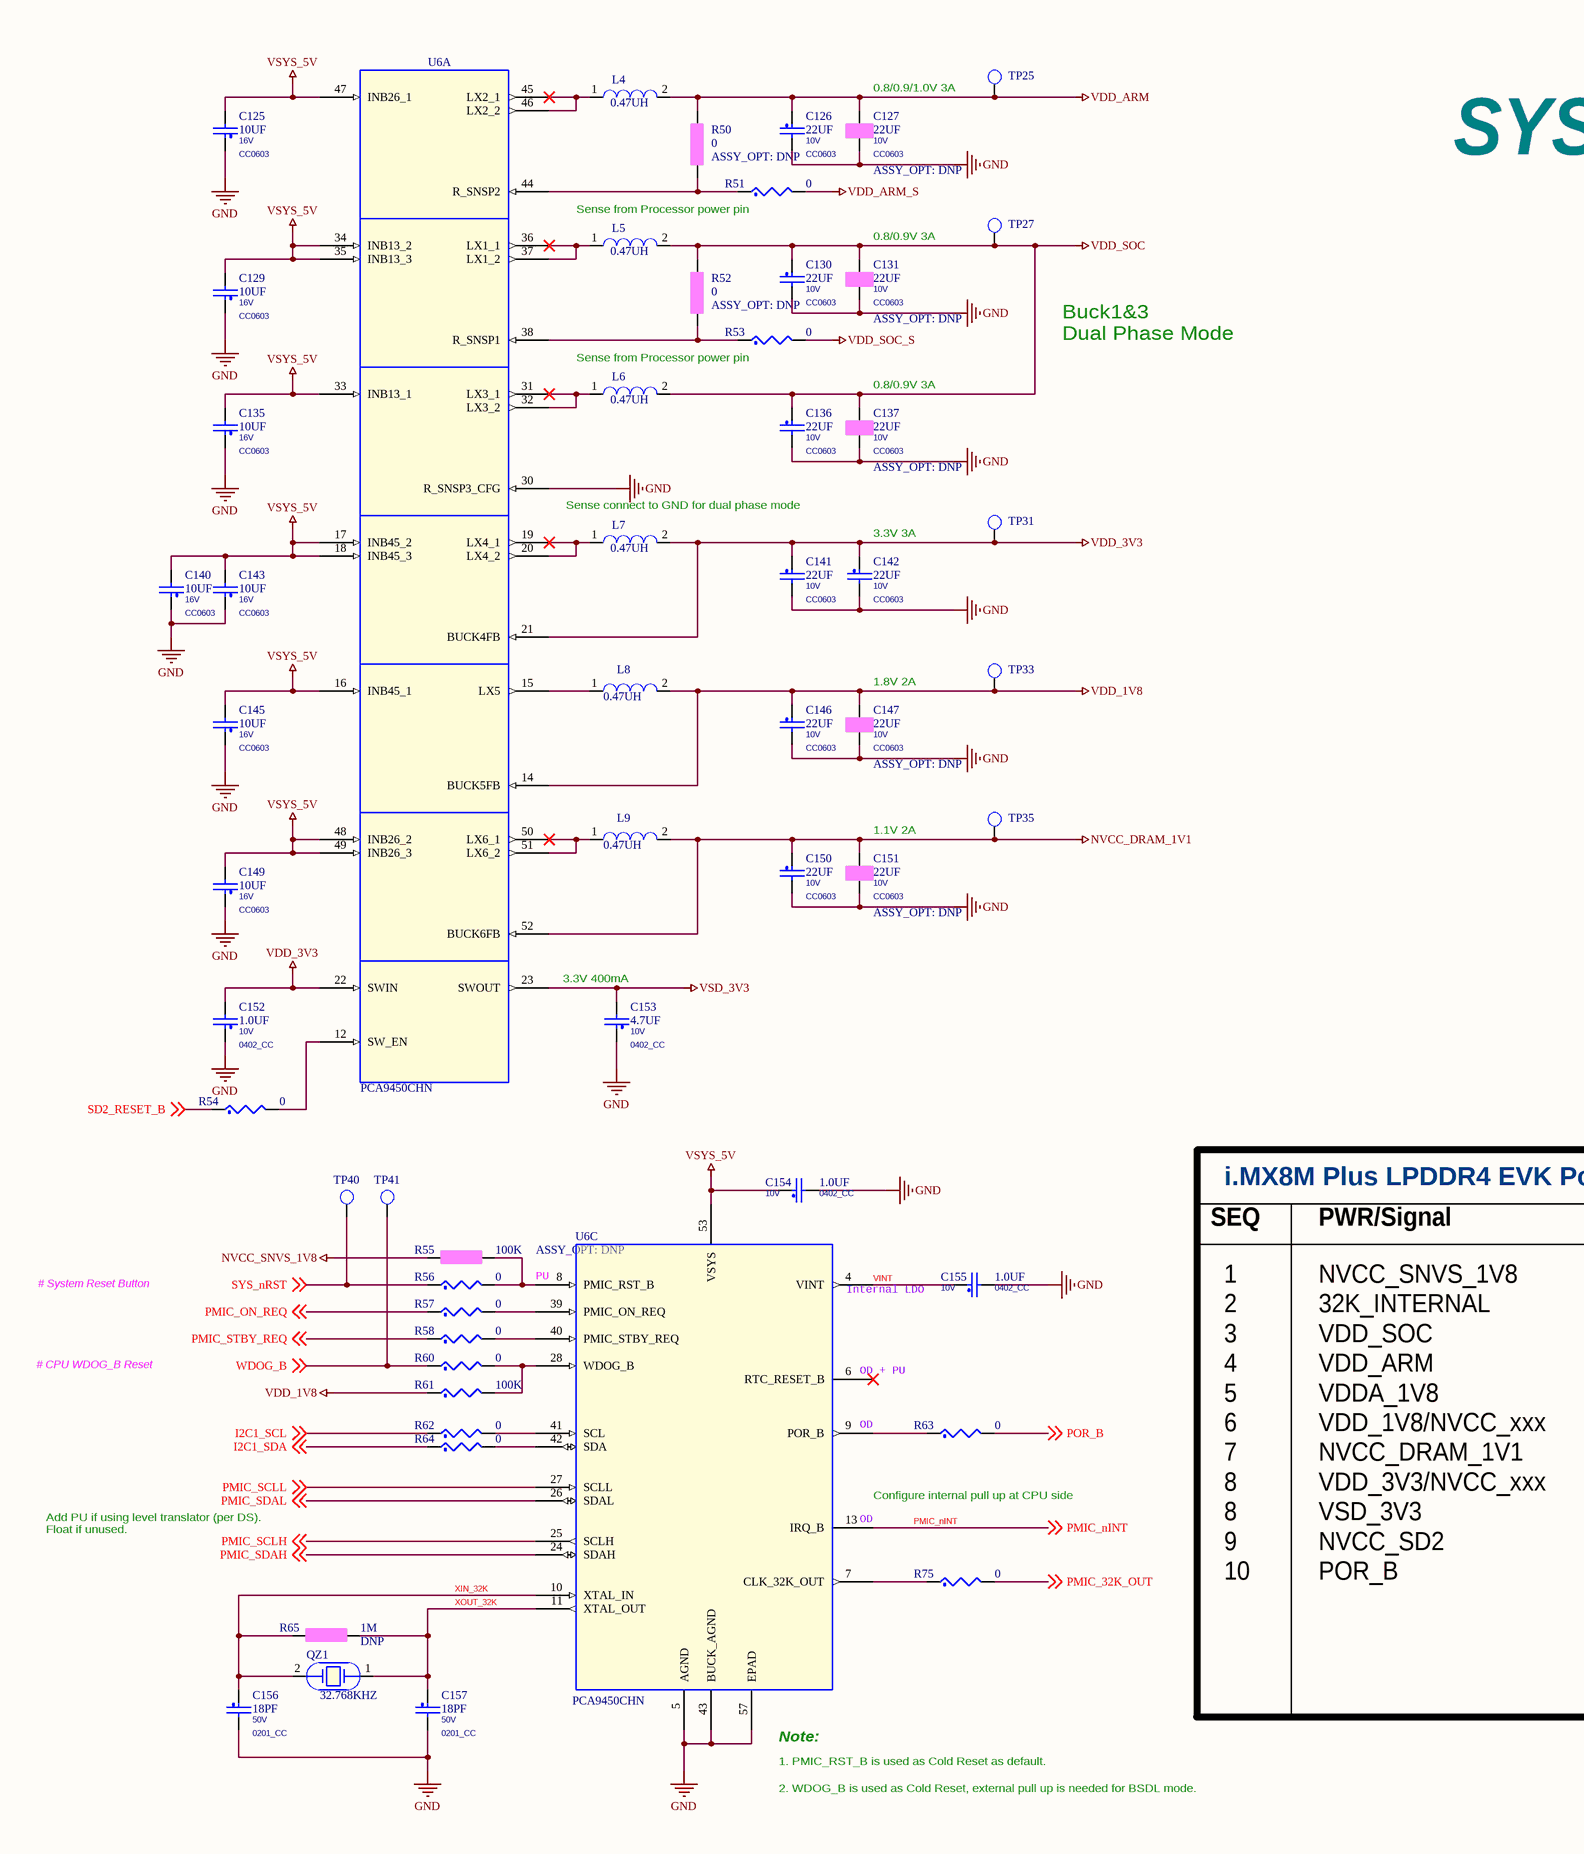
[diagram p15: Page11 PMIC.SchDoc, left]
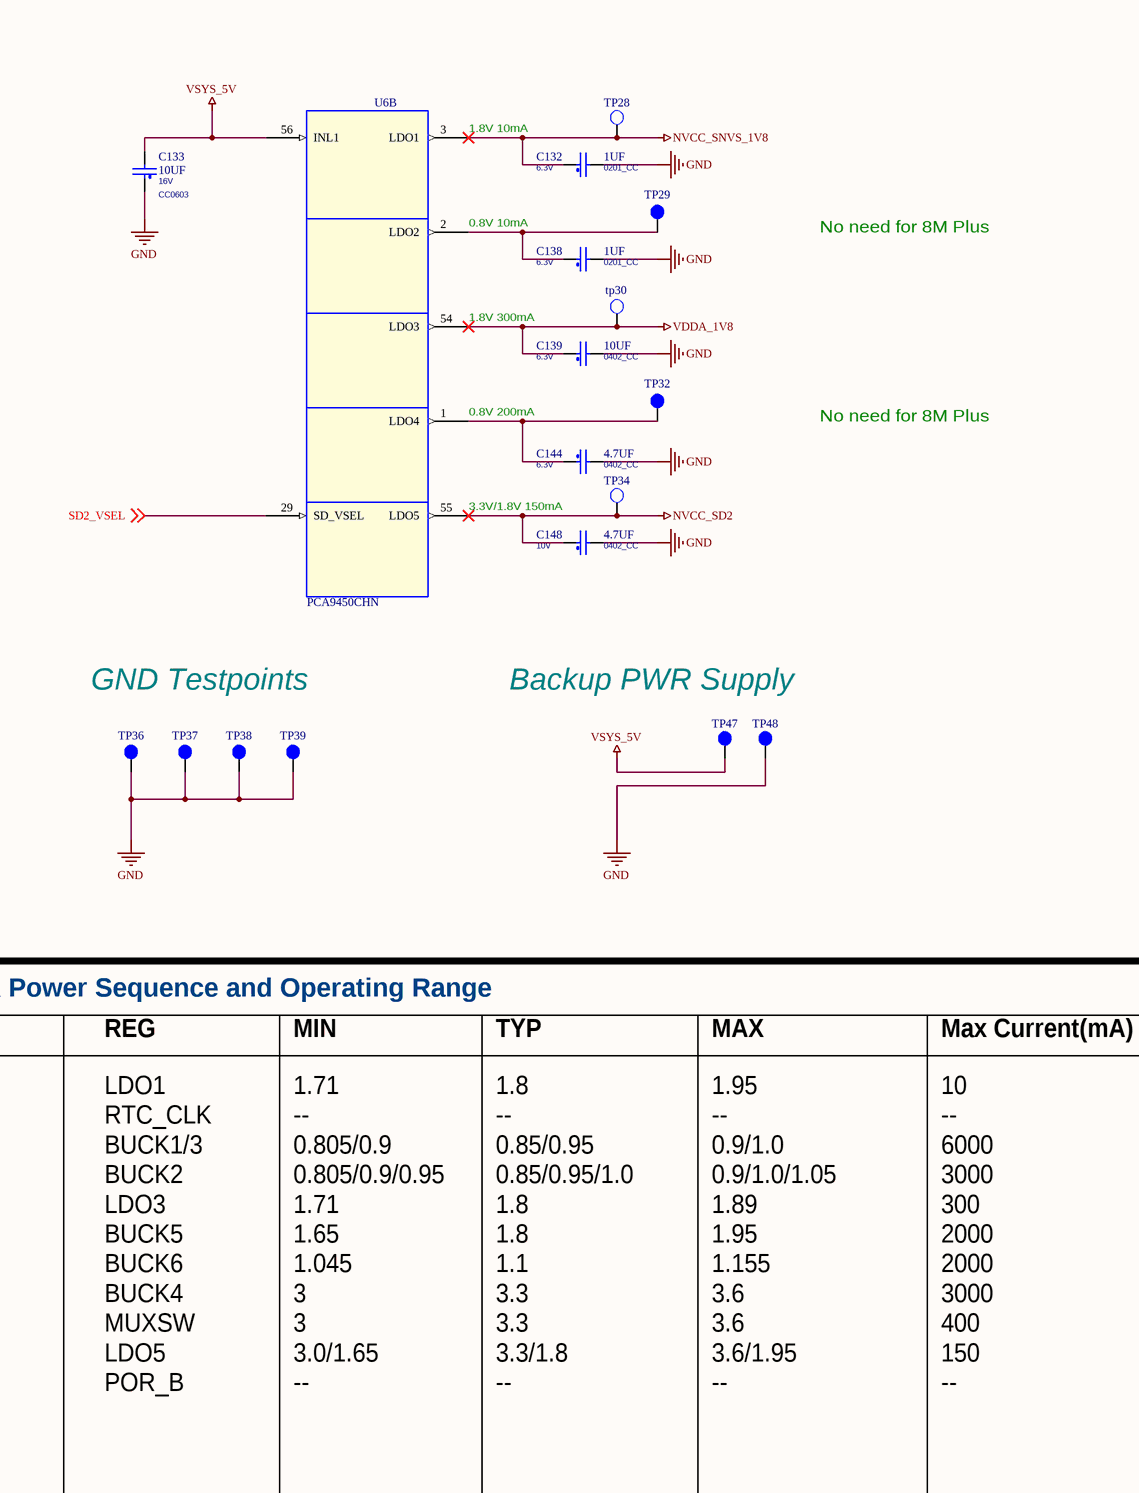
[diagram p16: Page11 PMIC.SchDoc, right]

### Parts
C125  10UF  VOLTAGE: 16V  [CC0603]
C126  22UF  VOLTAGE: 10V  [CC0603]
C127  22UF  ASSY_OPT: DNP  VOLTAGE: 10V  [CC0603]
C129  10UF  VOLTAGE: 16V  [CC0603]
C130  22UF  VOLTAGE: 10V  [CC0603]
C131  22UF  ASSY_OPT: DNP  VOLTAGE: 10V  [CC0603]
C132  1UF  VOLTAGE: 6.3V  [0201_CC]
C133  10UF  VOLTAGE: 16V  [CC0603]
C135  10UF  VOLTAGE: 16V  [CC0603]
C136  22UF  VOLTAGE: 10V  [CC0603]
C137  22UF  ASSY_OPT: DNP  VOLTAGE: 10V  [CC0603]
C138  1UF  VOLTAGE: 6.3V  [0201_CC]
C139  10UF  VOLTAGE: 6.3V  [0402_CC]
C140  10UF  VOLTAGE: 16V  [CC0603]
C141  22UF  VOLTAGE: 10V  [CC0603]
C142  22UF  VOLTAGE: 10V  [CC0603]
C143  10UF  VOLTAGE: 16V  [CC0603]
C144  4.7UF  voltage rating: 6.3V  [0402_CC]
C145  10UF  VOLTAGE: 16V  [CC0603]
C146  22UF  VOLTAGE: 10V  [CC0603]
C147  22UF  ASSY_OPT: DNP  VOLTAGE: 10V  [CC0603]
C148  4.7UF  VOLTAGE: 10V  [0402_CC]
C149  10UF  VOLTAGE: 16V  [CC0603]
C150  22UF  VOLTAGE: 10V  [CC0603]
C151  22UF  ASSY_OPT: DNP  VOLTAGE: 10V  [CC0603]
C152  1.0UF  VOLTAGE: 10V  [0402_CC]
C153  4.7UF  VOLTAGE: 10V  [0402_CC]
C154  1.0UF  VOLTAGE: 10V  [0402_CC]
C155  1.0UF  VOLTAGE: 10V  [0402_CC]
C156  18PF  VOLTAGE: 50V  [0201_CC]
C157  18PF  VOLTAGE: 50V  [0201_CC]
L4  0.47UH  [ind_sph2520]
L5  0.47UH  [ind_sph2520]
L6  0.47UH  [ind_sph2520]
L7  0.47UH  [ind_sph2520]
L8  0.47UH  [IND_2016A]
L9  0.47UH  [IND_2016A]
QZ1  32.768KHZ  [XTAL2-3P2X1P5-SM]
R50  0  ASSY_OPT: DNP  [0402_CC]
R51  0  [0402_CC]
R52  0  ASSY_OPT: DNP  [0402_CC]
R53  0  [0402_CC]
R54  0  [0402_CC]
R55  100K  ASSY_OPT: DNP  [0201_CC]
R56  0  [RC0402_25]
R57  0  [0402_CC]
R58  0  [0402_CC]
R60  0  [RC0402_25]
R61  100K  [0201_CC]
R62  0  [0402_CC]
R63  0  [0402_CC]
R64  0  [0402_CC]
R65  1M  ASSY_OPT: DNP  [0201_CC]
R75  0  [0402_CC]
TP25  TP_35MIL  [testpoint_35mil]  (value not drawn)
TP27  TP_35MIL  [testpoint_35mil]  (value not drawn)
TP28  TP_35MIL  [testpoint_35mil]  (value not drawn)
TP29  tpad_020  [tpad_020]  (value not drawn)
tp30  TP_35MIL  [testpoint_35mil]  (value not drawn)
TP31  TP_35MIL  [testpoint_35mil]  (value not drawn)
TP32  tpad_020  [tpad_020]  (value not drawn)
TP33  TP_35MIL  [testpoint_35mil]  (value not drawn)
TP34  TP_35MIL  [testpoint_35mil]  (value not drawn)
TP35  TP_35MIL  [testpoint_35mil]  (value not drawn)
TP36  TPAD_050  [TPAD_050]  (value not drawn)
TP37  TPAD_050  [TPAD_050]  (value not drawn)
TP38  TPAD_050  [TPAD_050]  (value not drawn)
TP39  TPAD_050  [TPAD_050]  (value not drawn)
TP40  TP_35MIL  [testpoint_35mil]  (value not drawn)
TP41  TP_35MIL  [testpoint_35mil]  (value not drawn)
TP47  TPAD_050  [TPAD_050]  (value not drawn)
TP48  TPAD_050  [TPAD_050]  (value not drawn)
U6  PCA9450CHN  [hvqfn56_0p4_7x7_ep4p7mm]  (parts A,B,C of 3)

### Nets
GND: C125.1 C126.2 C127.2 C129.1 C130.2 C131.2 C132.2 C133.1 C135.1 C136.2 C137.2 C138.2 C139.2 C140.1 C141.2 C142.2 C143.1 C144.2 C145.1 C146.2 C147.2 C148.2 C149.1 C150.2 C151.2 C152.1 C153.1 C154.2 C155.2 C156.2 C157.2 TP36.1(Pin1) TP37.1(Pin1) TP38.1(Pin1) TP39.1(Pin1) TP48.1(Pin1) U6.5(AGND) U6.30(R_SNSP3_CFG) U6.43(BUCK_AGND) U6.57(EPAD)
NVCC_DRAM_1V1: C150.1 C151.1 L9.2 TP35.1(TP) U6.52(BUCK6FB)  [project net ODT_CA_A]
NVCC_SD2: C148.1 TP34.1(TP) U6.55(LDO5)
NVCC_SNVS_1V8: C132.1 R55.1 TP28.1(TP) U6.3(LDO1)
VDD_1V8: C146.1 C147.1 L8.2 R61.1 TP33.1(TP) U6.14(BUCK5FB)
VDD_3V3: C141.1 C142.1 C152.2 L7.2 TP31.1(TP) U6.21(BUCK4FB) U6.22(SWIN)
VDD_ARM: C126.1 C127.1 L4.2 R50.1 R51.2 TP25.1(TP)  [also labelled VDD_ARM_S]
VDD_SOC: C130.1 C131.1 C136.1 C137.1 L5.2 L6.2 R52.1 R53.2 TP27.1(TP)  [also labelled VDD_SOC_S]
VDDA_1V8: C139.1 tp30.1(TP) U6.54(LDO3)
VSD_3V3: C153.2 U6.23(SWOUT)
VSYS_5V: C125.2 C129.2 C133.2 C135.2 C140.2 C143.2 C145.2 C149.2 C154.1 TP47.1(Pin1) U6.16(INB45_1) U6.17(INB45_2) U6.18(INB45_3) U6.33(INB13_1) U6.34(INB13_2) U6.35(INB13_3) U6.47(INB26_1) U6.48(INB26_2) U6.49(INB26_3) U6.53(VSYS) U6.56(INL1)
I2C1_SCL: R62.1 ; off-sheet I2C1_SCL
I2C1_SDA: R64.1 ; off-sheet I2C1_SDA
PMIC_32K_OUT: R75.2 ; off-sheet PMIC_32K_OUT
PMIC_nINT: U6.13(IRQ_B) ; off-sheet PMIC_nINT
PMIC_ON_REQ: R57.1 ; off-sheet PMIC_ON_REQ
PMIC_SCLH: U6.25(SCLH) ; off-sheet PMIC_SCLH
PMIC_SCLL: U6.27(SCLL) ; off-sheet PMIC_SCLL
PMIC_SDAH: U6.24(SDAH) ; off-sheet PMIC_SDAH
PMIC_SDAL: U6.26(SDAL) ; off-sheet PMIC_SDAL
PMIC_STBY_REQ: R58.1 ; off-sheet PMIC_STBY_REQ
POR_B: R63.2 ; off-sheet POR_B
SD2_RESET_B: R54.1 ; off-sheet SD2_RESET_B
SD2_VSEL: U6.29(SD_VSEL) ; off-sheet SD2_VSEL
SYS_nRST: R56.1 TP40.1(TP) ; off-sheet SYS_nRST
VINT: C155.1 U6.4(VINT)
WDOG_B: R60.1 TP41.1(TP) ; off-sheet WDOG_B
XIN_32K: C156.1 QZ1.2 R65.1 U6.10(XTAL_IN)
XOUT_32K: C157.1 QZ1.1 R65.2 U6.11(XTAL_OUT)
NetC138_1: C138.1 TP29.1(Pin1) U6.2(LDO2)
NetC144_1: C144.1 TP32.1(Pin1) U6.1(LDO4)
NetL4_1: L4.1 U6.45(LX2_1) U6.46(LX2_2)
NetL5_1: L5.1 U6.36(LX1_1) U6.37(LX1_2)
NetL6_1: L6.1 U6.31(LX3_1) U6.32(LX3_2)
NetL7_1: L7.1 U6.19(LX4_1) U6.20(LX4_2)
NetL8_1: L8.1 U6.15(LX5)
NetL9_1: L9.1 U6.50(LX6_1) U6.51(LX6_2)
NetR50_2: R50.2 R51.1 U6.44(R_SNSP2)
NetR52_2: R52.2 R53.1 U6.38(R_SNSP1)
NetR54_2: R54.2 U6.12(SW_EN)
NetR55_2: R55.2 R56.2 U6.8(PMIC_RST_B)
NetR57_2: R57.2 U6.39(PMIC_ON_REQ)
NetR58_2: R58.2 U6.40(PMIC_STBY_REQ)
NetR60_2: R60.2 R61.2 U6.28(WDOG_B)
NetR62_2: R62.2 U6.41(SCL)
NetR63_1: R63.1 U6.9(POR_B)
NetR64_2: R64.2 U6.42(SDA)
NetR75_1: R75.1 U6.7(CLK_32K_OUT)

Not connected (* = marked no-connect by the designer): U6 6(RTC_RESET_B)*

### Notes on the sheet
- 0.8/0.9/1.0V 3A
- Sense from Processor power pin
- SYS PMIC
- (near C131) 0.8/0.9V 3A
- Buck1&3
  Dual Phase Mode
- (near U6) 1.8V 10mA
- (near C137) 0.8/0.9V 3A
- (near U6) 0.8V 10mA
- No need for 8M Plus
- (near L7) Sense connect to GND for dual phase mode
- (near C142) 3.3V 3A
- 1.8V 300mA
- (near U6) 0.8V 200mA
- (near C147) 1.8V 2A
- 3.3V/1.8V 150mA
- (near C151) 1.1V 2A
- GND Testpoints
- Backup PWR Supply
- (near C153) 3.3V 400mA
- SEQ
- i.MX8M Plus LPDDR4 EVK Power Sequence and Operating Range
- PWR/Signal
- REG
- MIN
- TYP
- MAX
- Max Current(mA)
- # System Reset Button
- (near U6) PU
- (near U6) Internal LDO
- # CPU WDOG_B Reset
- (near U6) OD + PU
- (near U6) OD
- Configure internal pull up at CPU side
- Add PU if using level translator (per DS).
  Float if unused.
- 1
  2
  3
  4
  5
  6
  7
  8
  8
  9
  10
- NVCC_SNVS_1V8
  32K_INTERNAL
  VDD_SOC
  VDD_ARM
  VDDA_1V8
  VDD_1V8/NVCC_xxx
  NVCC_DRAM_1V1
  VDD_3V3/NVCC_xxx
  VSD_3V3
  NVCC_SD2
  POR_B
- LDO1
  RTC_CLK
  BUCK1/3
  BUCK2
  LDO3
  BUCK5
  BUCK6
  BUCK4
  MUXSW
  LDO5
  POR_B
- 1.71
  --
  0.805/0.9
  0.805/0.9/0.95
  1.71
  1.65
  1.045
  3
  3
  3.0/1.65
  --
- 1.8
  --
  0.85/0.95
  0.85/0.95/1.0
  1.8
  1.8
  1.1
  3.3
  3.3
  3.3/1.8
  --
- 1.95
  --
  0.9/1.0
  0.9/1.0/1.05
  1.89
  1.95
  1.155
  3.6
  3.6
  3.6/1.95
  --
- 10
  --
  6000
  3000
  300
  2000
  2000
  3000
  400
  150
  --
- 1. PMIC_RST_B is used as Cold Reset as default.
- (near U6) Note:
- 2. WDOG_B is used as Cold Reset, external pull up is needed for BSDL mode.

### Library data of the parts
C125 C133 = CAP_NP: CAP CER 10.0uF 16V 10% X5R 0603; CLASS: DISCRETE; Temp Range: -55¡ãC to +85¡ãC; FPLIST: CC0603_OV,CC0603,0603_CC,cc0603_0805_nsp; CAD_APPROVED: Yes; MFG_PN01: GRM188R61C106KAALD; MFG_NAME01: MURATA; AGILE_PN: 150-80060; Package Type: SMT; Package Size: 0603; HEIGHT: 0.9MM; Temp_Range: -55¡ãC to +85¡ãC; ROHS: Yes; Tolerance: 10%; PCB Footprint: CC0603
C126 C136 C141 C146 C150 = CAP_NP: CAP CER 22uF 10V 20% X5R 0603; CLASS: DISCRETE; FPLIST: CC0603_OV,CC0603,0603_CC; CAD_APPROVED: Yes; MFG_PN01: C1608X5R1A226M080AC; MFG_NAME01: TDK; AGILE_PN: 150-79530; WVDC: 6.3V; SIGNAL_MODEL: DEFAULT_CAPACITOR_2.2e+07pF_2_1; HEIGHT: 1MM; ROHS: Yes; Tolerance: 20%; Package Size: 0603; PCB Footprint: CC0603
C127 C131 C147 = CAP_NP: CAP CER 22uF 10V 20% X5R 0603; CLASS: DISCRETE; SIGNAL_MODEL: DEFAULT_CAPACITOR_2.2e+07pF_2_1; FPLIST: CC0603_OV,CC0603,0603_CC; CAD_APPROVED: Yes; MFG_PN01: C1608X5R1A226M080AC; MFG_NAME01: TDK; AGILE_PN: 150-79530; WVDC: 6.3V; HEIGHT: 1MM; ROHS: Yes; Tolerance: 20%; Package Size: 0603; PCB Footprint: CC0603
C129 C135 C140 = CAP_NP: CAP CER 10.0uF 16V 10% X5R 0603; CLASS: DISCRETE; Temp Range: -55¡ãC to +85¡ãC; AGILE_PN: 150-80060; MFG_NAME01: MURATA; MFG_PN01: GRM188R61C106KAALD; CAD_APPROVED: Yes; FPLIST: CC0603_OV,CC0603,0603_CC,cc0603_0805_nsp; Package Type: SMT; Package Size: 0603; Tolerance: 10%; ROHS: Yes; Temp_Range: -55¡ãC to +85¡ãC; HEIGHT: 0.9MM; PCB Footprint: CC0603
C130 = CAP_NP: CAP CER 22uF 10V 20% X5R 0603; CLASS: DISCRETE; SIGNAL_MODEL: DEFAULT_CAPACITOR_2.2e+07pF_2_1; WVDC: 6.3V; AGILE_PN: 150-79530; MFG_NAME01: TDK; MFG_PN01: C1608X5R1A226M080AC; CAD_APPROVED: Yes; FPLIST: CC0603_OV,CC0603,0603_CC; Tolerance: 20%; ROHS: Yes; HEIGHT: 1MM; Package Size: 0603; PCB Footprint: CC0603
C132 = CAP_NP: CAP CER 1uF 6.3V 20% X5R 0201; CLASS: DISCRETE; AGILE_PN: 150-79407; MFG_NAME01: AVX; MFG_PN01: 02016D105MAT2A; CAD_APPROVED: Yes; FPLIST: CC0201,CC0201_HD,0201_CC,0201_CC_012SM_NSP; Tolerance: 20%; ROHS: Yes; HEIGHT: 0.35MM; PCB Footprint: 0201_CC; Package Size: 0201; Package Type: 7¡± reel
C137 C142 C151 = CAP_NP: CAP CER 22uF 10V 20% X5R 0603; CLASS: DISCRETE; WVDC: 6.3V; AGILE_PN: 150-79530; MFG_NAME01: TDK; MFG_PN01: C1608X5R1A226M080AC; CAD_APPROVED: Yes; FPLIST: CC0603_OV,CC0603,0603_CC; SIGNAL_MODEL: DEFAULT_CAPACITOR_2.2e+07pF_2_1; Tolerance: 20%; ROHS: Yes; HEIGHT: 1MM; Package Size: 0603; PCB Footprint: CC0603
C138 = CAP_NP: as C118 on sheet Page09 eMMC_QSPI; HEIGHT: 0.35MM; ROHS: Yes; Tolerance: 20%; PCB Footprint: 0201_CC; Package Size: 0201; Package Type: 7¡± reel
C139 = CAP_NP: as C113 on sheet Page09 eMMC_QSPI; HEIGHT: 0.65 MM; ROHS: Yes; Tolerance: 20%; PCB Footprint: 0402_CC
C143 C145 C149 = CAP_NP: CAP CER 10.0uF 16V 10% X5R 0603; CLASS: DISCRETE; FPLIST: CC0603_OV,CC0603,0603_CC,cc0603_0805_nsp; CAD_APPROVED: Yes; Temp_Range: -55¡ãC to +85¡ãC; MFG_PN01: GRM188R61C106KAALD; MFG_NAME01: MURATA; AGILE_PN: 150-80060; HEIGHT: 0.9MM; ROHS: Yes; Tolerance: 10%; Package Size: 0603; Package Type: SMT; Temp Range: -55¡ãC to +85¡ãC; PCB Footprint: CC0603
C144 = CAP_NP: CAP CER 4.7UF 6.3V 20% X5R 0402; CLASS: DISCRETE; FPLIST: CC0402_25,CC0402_HD,0402_CC; CAD_APPROVED: Yes; MFG_PN01: C1005X5R0J475M050BC; MFG_NAME01: TDK; AGILE_PN: 150-78463; PCB Footprint: 0402_CC; HEIGHT: 0.65MM; ROHS: Yes; Tolerance: 20%; VOLTAGE: 6.3V
C148 = CAP_NP: as C110 on sheet Page09 eMMC_QSPI; HEIGHT: 0.65MM; ROHS: Yes; Tolerance: 10%; PCB Footprint: 0402_CC
C152 C154 C155 = CAP_NP: CAP CER 1.0UF 10V 10% X5R 0402; CLASS: DISCRETE; AGILE_PN: 150-75772; MFG_NAME01: YAGEO AMERICA; MFG_PN01: CC0402KRX5R6BB105; CAD_APPROVED: Yes; FPLIST: CC0402_25,CC0402_HD,0402_CC; ROHS: Yes; HEIGHT: 0.6MM; PCB Footprint: 0402_CC; Package Size: 0402
C153 = CAP_NP: CAP CER 4.7uF 10V 10% X5R 0402; CLASS: DISCRETE; AGILE_PN: 150-80044; MFG_NAME01: Samsung Electro Mechanics; MFG_PN01: CL05A475KP5NRNC; CAD_APPROVED: Yes; FPLIST: CC0402_25,CC0402_HD,0402_CC; Tolerance: 10%; ROHS: Yes; HEIGHT: 0.65MM; PCB Footprint: 0402_CC
C156 = CAP_NP: as C164 on sheet Page08 CPU MISC; Tolerance: 5%; ROHS: Yes; HEIGHT: 0.33MM; PCB Footprint: 0201_CC; Package Size: 0201; Package Type: &#966;180mm Paper taping
C157 = CAP_NP: as C165 on sheet Page08 CPU MISC; HEIGHT: 0.33MM; ROHS: Yes; Tolerance: 5%; PCB Footprint: 0201_CC; Package Size: 0201; Package Type: &#966;180mm Paper taping
L4-L7 = INDUCTOR: IND PWR 0.47uH@1MHZ 4.7A 20% SMT; PART_TYPE: INDUCTOR\POWER; CLASS: DISCRETE; CAD_APPROVED: Yes; Temp_Range: -40¡ãC to +125¡ãC; MFG_PN01: WPN252012ER47MT; MFG_NAME01: SHENZHEN SUNLORD ELECTRONICS CO., LTD; AGILE_PN: 180-78647; PCB Footprint: ind_sph2520; Tolerance: 20%; HEIGHT: 1.2MM; ROHS: Yes; TOL: 20%; Temp Range: -40¡ãC to +125¡ãC
L8 = INDUCTOR: IND PWR 0.47uH@1MHz 3.4A 20% 2016; PART_TYPE: INDUCTOR\POWER; CLASS: DISCRETE; AGILE_PN: 180-78995; MFG_NAME01: SHENZHEN SUNLORD ELECTRONICS CO., LTD; MFG_PN01: WPN201612HR47MT; Temp_Range: -40¡ãC to 125¡ãC; CAD_APPROVED: Yes; PCB Footprint: IND_2016A; Tolerance: 20%; ROHS: Yes; HEIGHT: 1.2MM; Package Size: 2x1.6x1.2 mm; Temp Range: -40¡ãC to 125¡ãC
L9 = INDUCTOR: IND PWR 0.47uH@1MHz 3.4A 20% 2016; PART_TYPE: INDUCTOR\POWER; CLASS: DISCRETE; CAD_APPROVED: Yes; Temp_Range: -40¡ãC to 125¡ãC; MFG_PN01: WPN201612HR47MT; MFG_NAME01: SHENZHEN SUNLORD ELECTRONICS CO., LTD; AGILE_PN: 180-78995; PCB Footprint: IND_2016A; HEIGHT: 1.2MM; ROHS: Yes; Tolerance: 20%; Package Size: 2x1.6x1.2 mm; Temp Range: -40¡ãC to 125¡ãC
QZ1 = XTAL: XTAL 32.768KHZ 12.5PF 20PPM 3.2X1.5MM SMT; CLASS: IC; CAD_APPROVED: Yes; MFG_PN01: ABS07-32.768KHZ-T; MFG_NAME01: Abracon Corporation; AGILE_PN: 230-77653; PCB Footprint: XTAL2-3P2X1P5-SM; HEIGHT: 0.9MM; ROHS: Yes
R50-R54 R56 = RES: RES MF ZERO OHM 1/16W 5% 0402; CLASS: DISCRETE; FPLIST: RC0402_25,RC0402_HD,RC0402_X2,0402_CC; CAD_APPROVED: Yes; MFG_PN01: MCR01MZPJ000; MFG_NAME01: ROHM; AGILE_PN: 470-75394; HEIGHT: 0.45 MM; ROHS: Yes; Tolerance: 5%; VOLTAGE: 1/16W
  R50-R54: PCB Footprint: 0402_CC
  R56: PCB Footprint: RC0402_25
R55 = RES: as R28 on sheet Page08 CPU MISC; HEIGHT: 0.26MM; ROHS: Yes; Tolerance: 1%; PCB Footprint: 0201_CC
R57 R63 R75 = RES: RES MF ZERO OHM 1/16W 5% 0402; CLASS: DISCRETE; CAD_APPROVED: Yes; MFG_PN01: MCR01MZPJ000; MFG_NAME01: ROHM; AGILE_PN: 470-75394; HEIGHT: 0.45 MM; ROHS: Yes; Tolerance: 5%; PCB Footprint: 0402_CC; VOLTAGE: 1/16W
R58 R60 R62 R64 = RES: RES MF ZERO OHM 1/16W 5% 0402; CLASS: DISCRETE; AGILE_PN: 470-75394; MFG_NAME01: ROHM; MFG_PN01: MCR01MZPJ000; CAD_APPROVED: Yes; FPLIST: RC0402_25,RC0402_HD,RC0402_X2,0402_CC; Tolerance: 5%; ROHS: Yes; HEIGHT: 0.45 MM; VOLTAGE: 1/16W
  R58 R62 R64: PCB Footprint: 0402_CC
  R60: PCB Footprint: RC0402_25
R61 = RES: as R29 on sheet Page08 CPU MISC; Tolerance: 1%; ROHS: Yes; HEIGHT: 0.26MM; PCB Footprint: 0201_CC
R65 = RES: RES MF 1.0M 1/20W 5% AEC-Q200 0201; CLASS: DISCRETE; FPLIST: RC0201,0201_CC; CAD_APPROVED: Yes; Temp_Range: 55¡ãC ~ 125¡ãC; MFG_PN01: ERJ-1GNJ105C; MFG_NAME01: PANASONIC; AGILE_PN: 470-79975; VOLTAGE: 25V; HEIGHT: 0.26MM; ROHS: Yes; Tolerance: 5%; PCB Footprint: 0201_CC; Temp Range: 55¡ãC ~ 125¡ãC
TP25 TP31 TP33-TP35 TP40 TP41 = T POINT R: as TP8 on sheet Page08 CPU MISC; HEIGHT: 0.1MM; ROHS: Yes; PCB Footprint: testpoint_35mil
TP27 TP28 tp30 = T POINT R: as TP7 on sheet Page08 CPU MISC; ROHS: Yes; HEIGHT: 0.1MM; PCB Footprint: testpoint_35mil
TP29 = TESTLOOP: as TP3 on sheet Page08 CPU MISC; HEIGHT: 0.1MM; ROHS: Yes; PCB Footprint: tpad_020
TP32 = TESTLOOP: as TP4 on sheet Page08 CPU MISC; ROHS: Yes; HEIGHT: 0.1MM; PCB Footprint: tpad_020
TP36 TP37 TP39 = TESTLOOP: TEST POINT PAD 50MIL DIA SMT, NO PART TO ORDER; ASSY_OPT: DNP; CLASS: IO; AGILE_PN: 211-76644; MFG_NAME01: NOTACOMPONENT; CAD_APPROVED: Yes; PCB Footprint: TPAD_050; MFG_PN01: NOTACOMPONENT; ROHS: Yes; HEIGHT: 0.1MM
TP38 = TESTLOOP: TEST POINT PAD 50MIL DIA SMT, NO PART TO ORDER; ASSY_OPT: DNP; CLASS: IO; CAD_APPROVED: Yes; MFG_PN01: NOTACOMPONENT; AGILE_PN: 211-76644; PCB Footprint: TPAD_050; HEIGHT: 0.1MM; ROHS: Yes; MFG_NAME01: NOTACOMPONENT
TP47 = TESTLOOP: TEST POINT PAD 50MIL DIA SMT, NO PART TO ORDER; ASSY_OPT: DNP; CLASS: IO; MFG_PN01: NOTACOMPONENT; CAD_APPROVED: Yes; AGILE_PN: 211-76644; MFG_NAME01: NOTACOMPONENT; ROHS: Yes; HEIGHT: 0.1MM; PCB Footprint: TPAD_050
TP48 = TESTLOOP: TEST POINT PAD 50MIL DIA SMT, NO PART TO ORDER; ASSY_OPT: DNP; CLASS: IO; AGILE_PN: 211-76644; CAD_APPROVED: Yes; MFG_NAME01: NOTACOMPONENT; HEIGHT: 0.1MM; ROHS: Yes; MFG_PN01: NOTACOMPONENT; PCB Footprint: TPAD_050
U6 = PCA9450_HVQFN56P_A: IC POWER MANAGEMENT 2.7-5.5V HVQFN56; SPLIT_INST: TRUE; SWAP_INFO: (S1+S2+S3); PRE_APN: 315-82348; Temp_Range: -40C to +105C; MFG_NAME01: NXP SEMICONDUCTORS; AGILE_PN: TMP-WF-36306; CLASS: IC; PCB Footprint: hvqfn56_0p4_7x7_ep4p7mm; HEIGHT: 1MM; ROHS: Yes; MFG_PN01: PCA9450CHN; VOLTAGE: 2.7-5.5V; Temp Range: -40C to +105C